# EAGLE board 8BIT_ADD_SUB (EAGLE 6.5.0), part 1 of 2
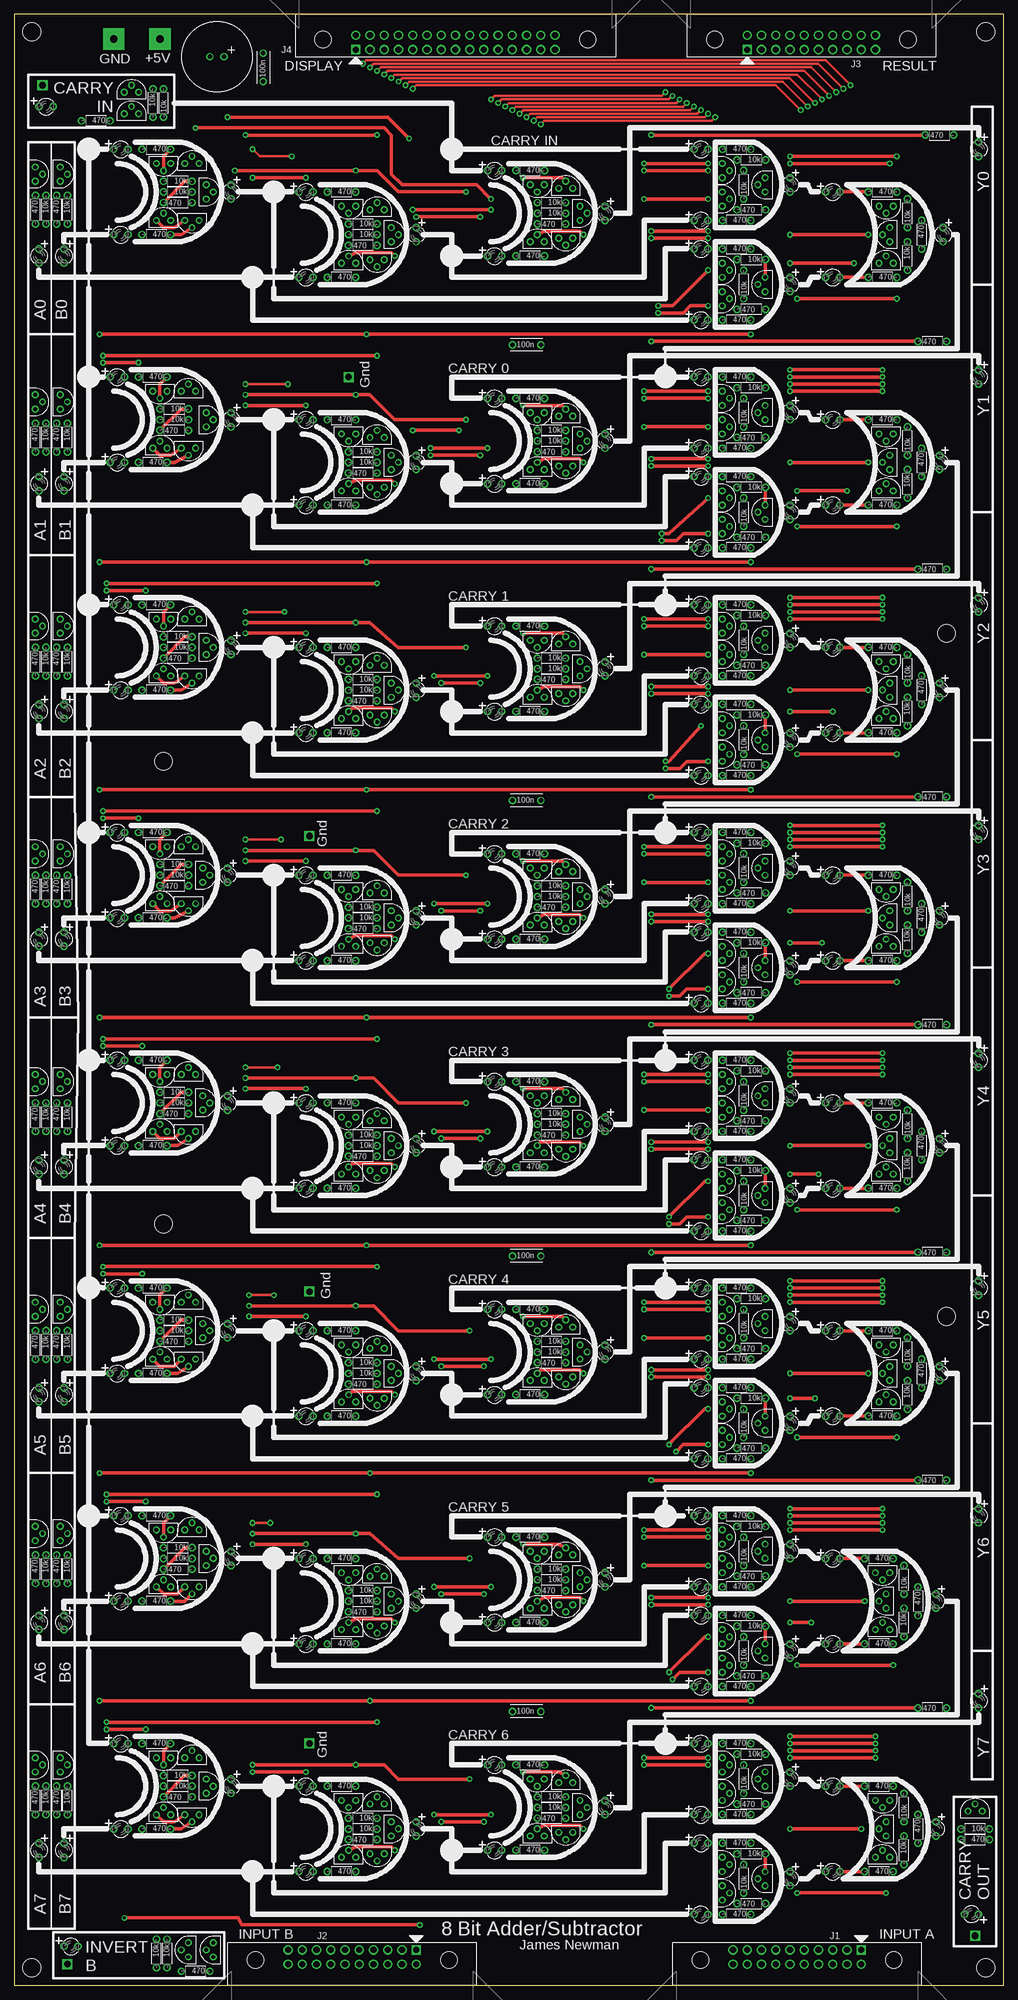
[diagram p25: board, top side]
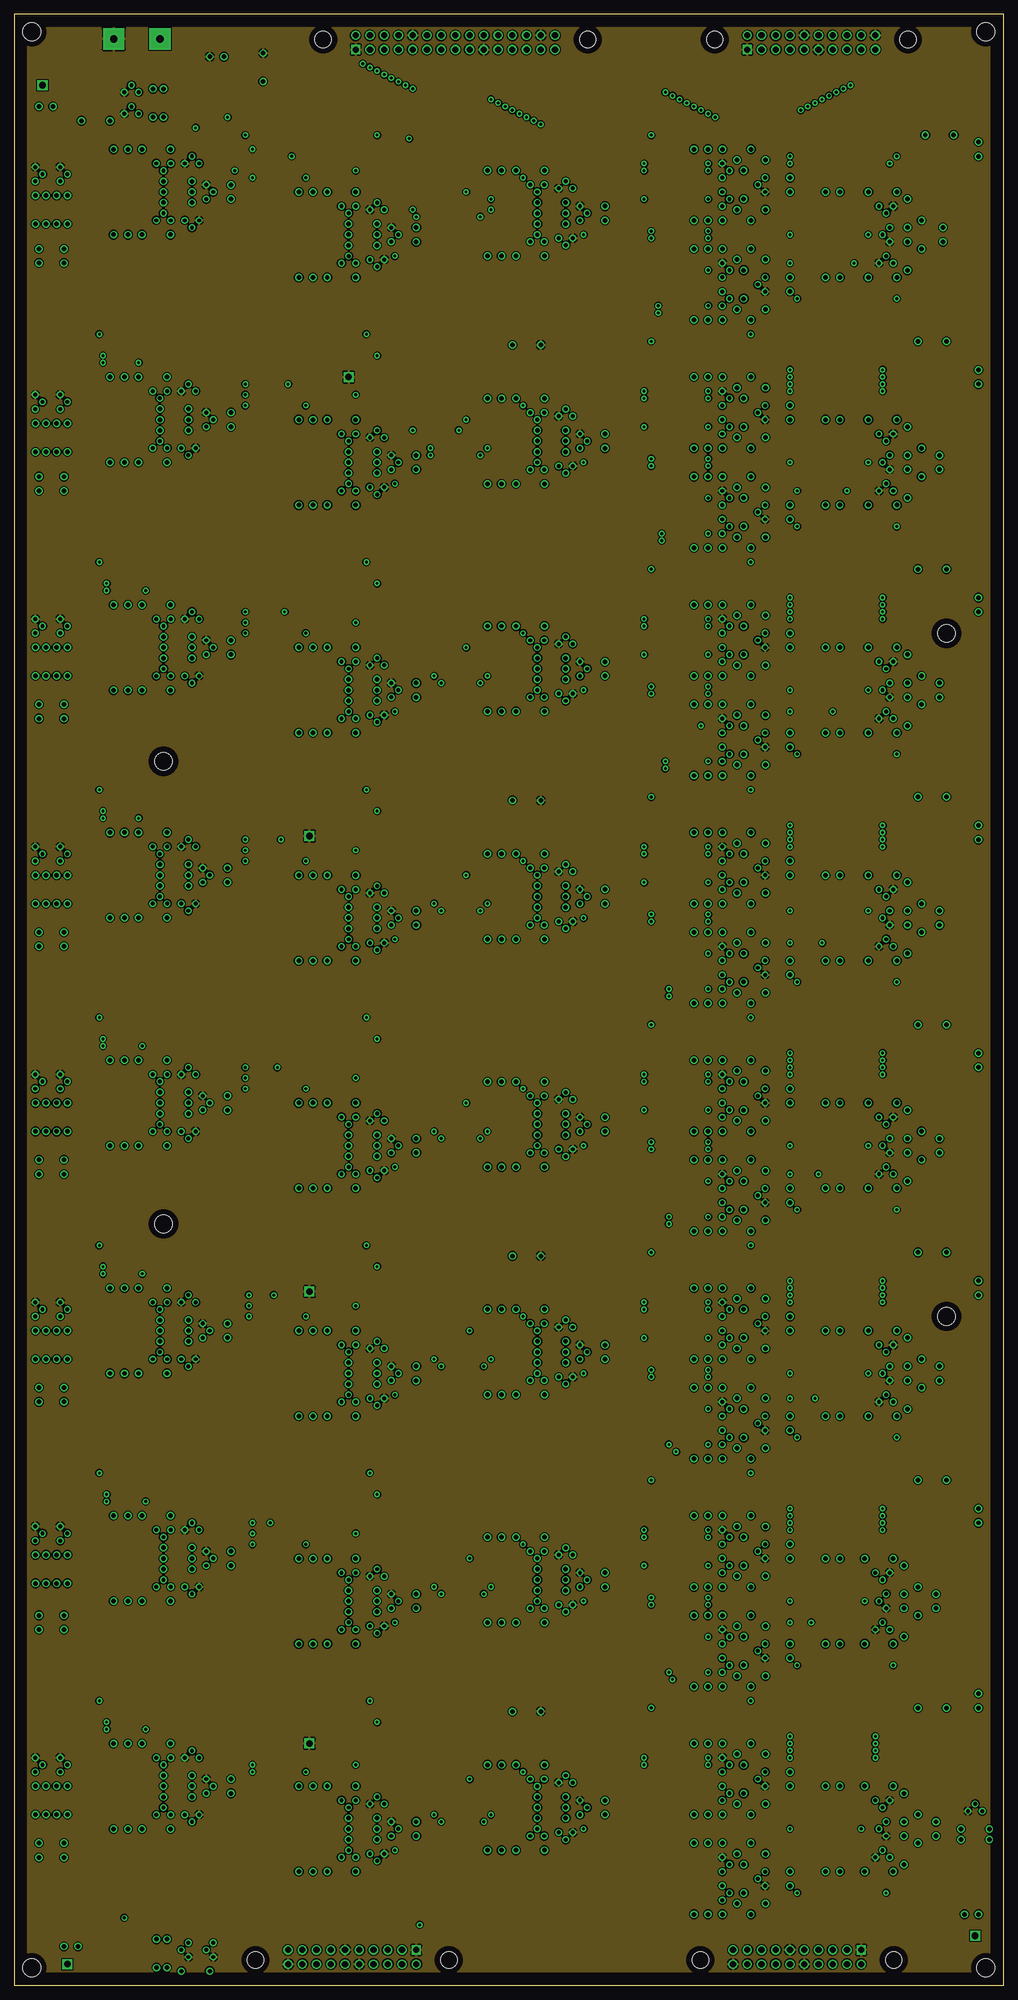
[diagram p26: board, inner layer Route2]
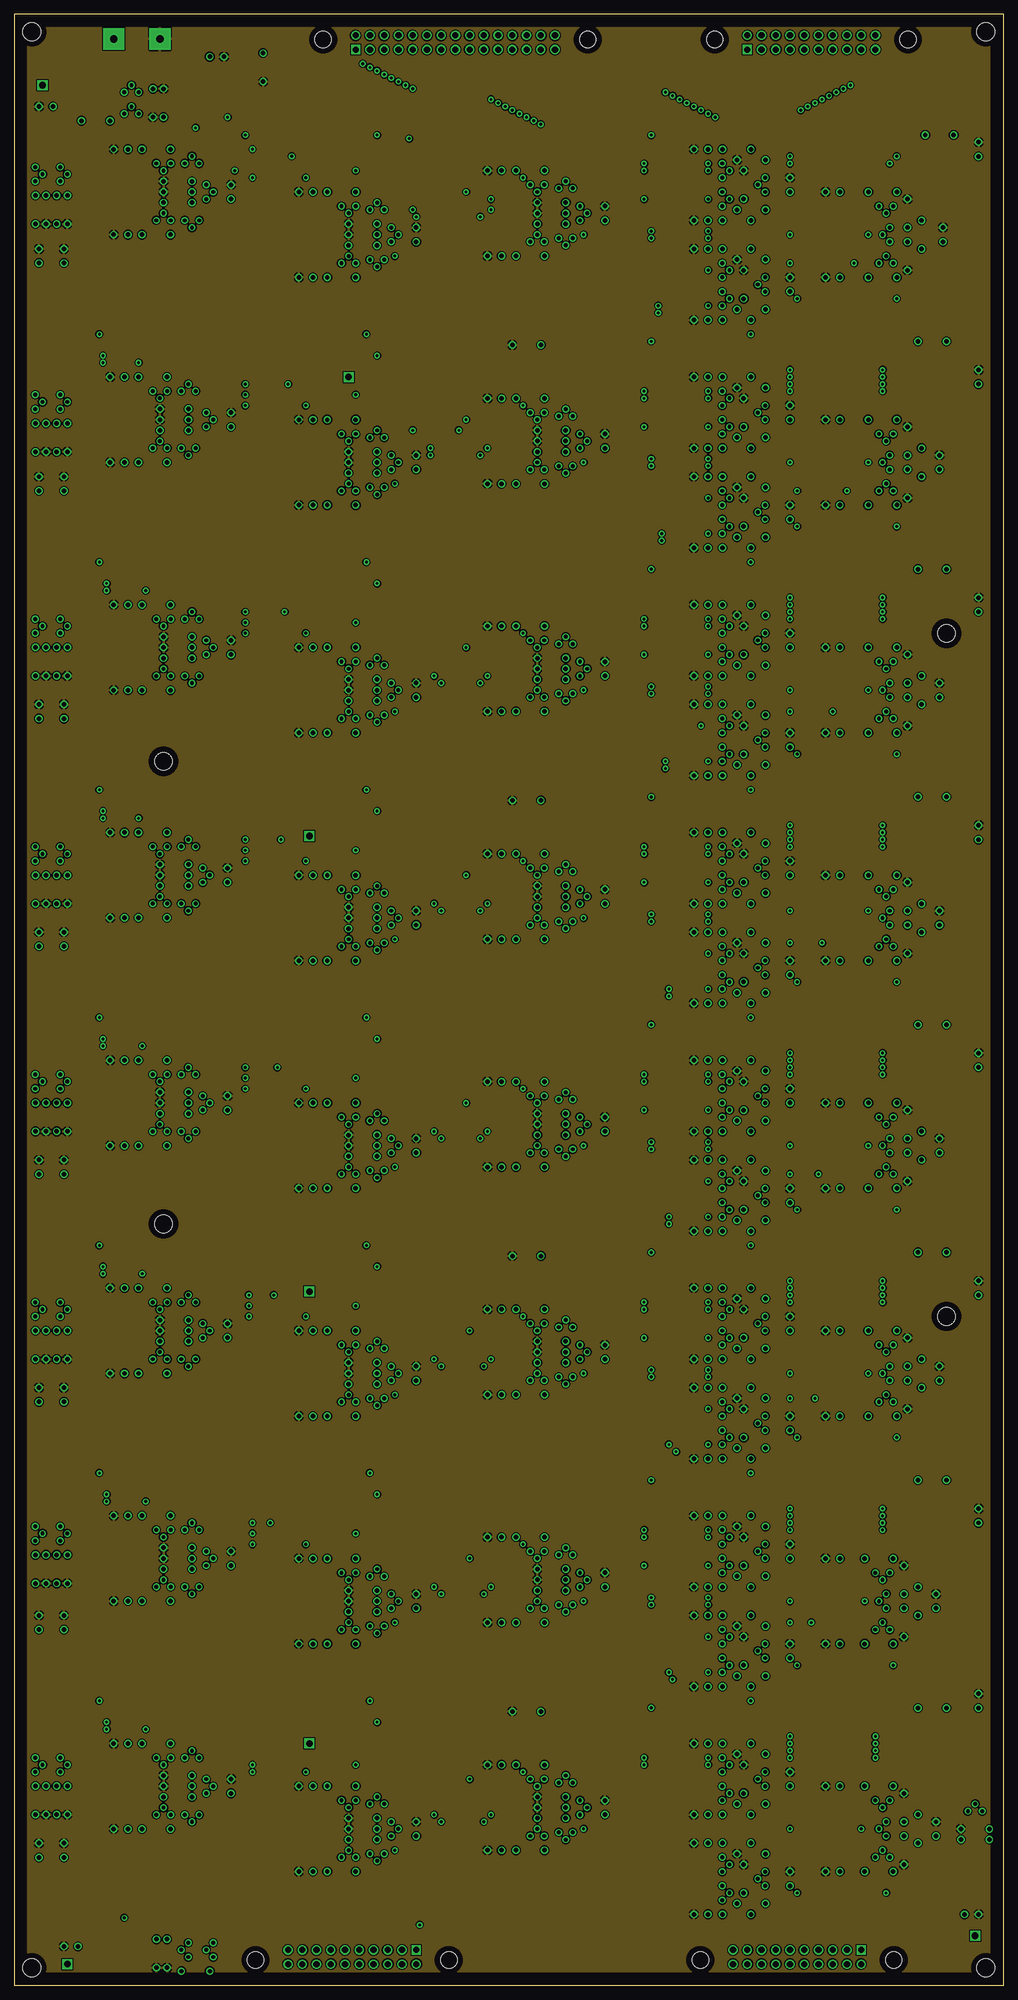
[diagram p27: board, inner layer Route3]
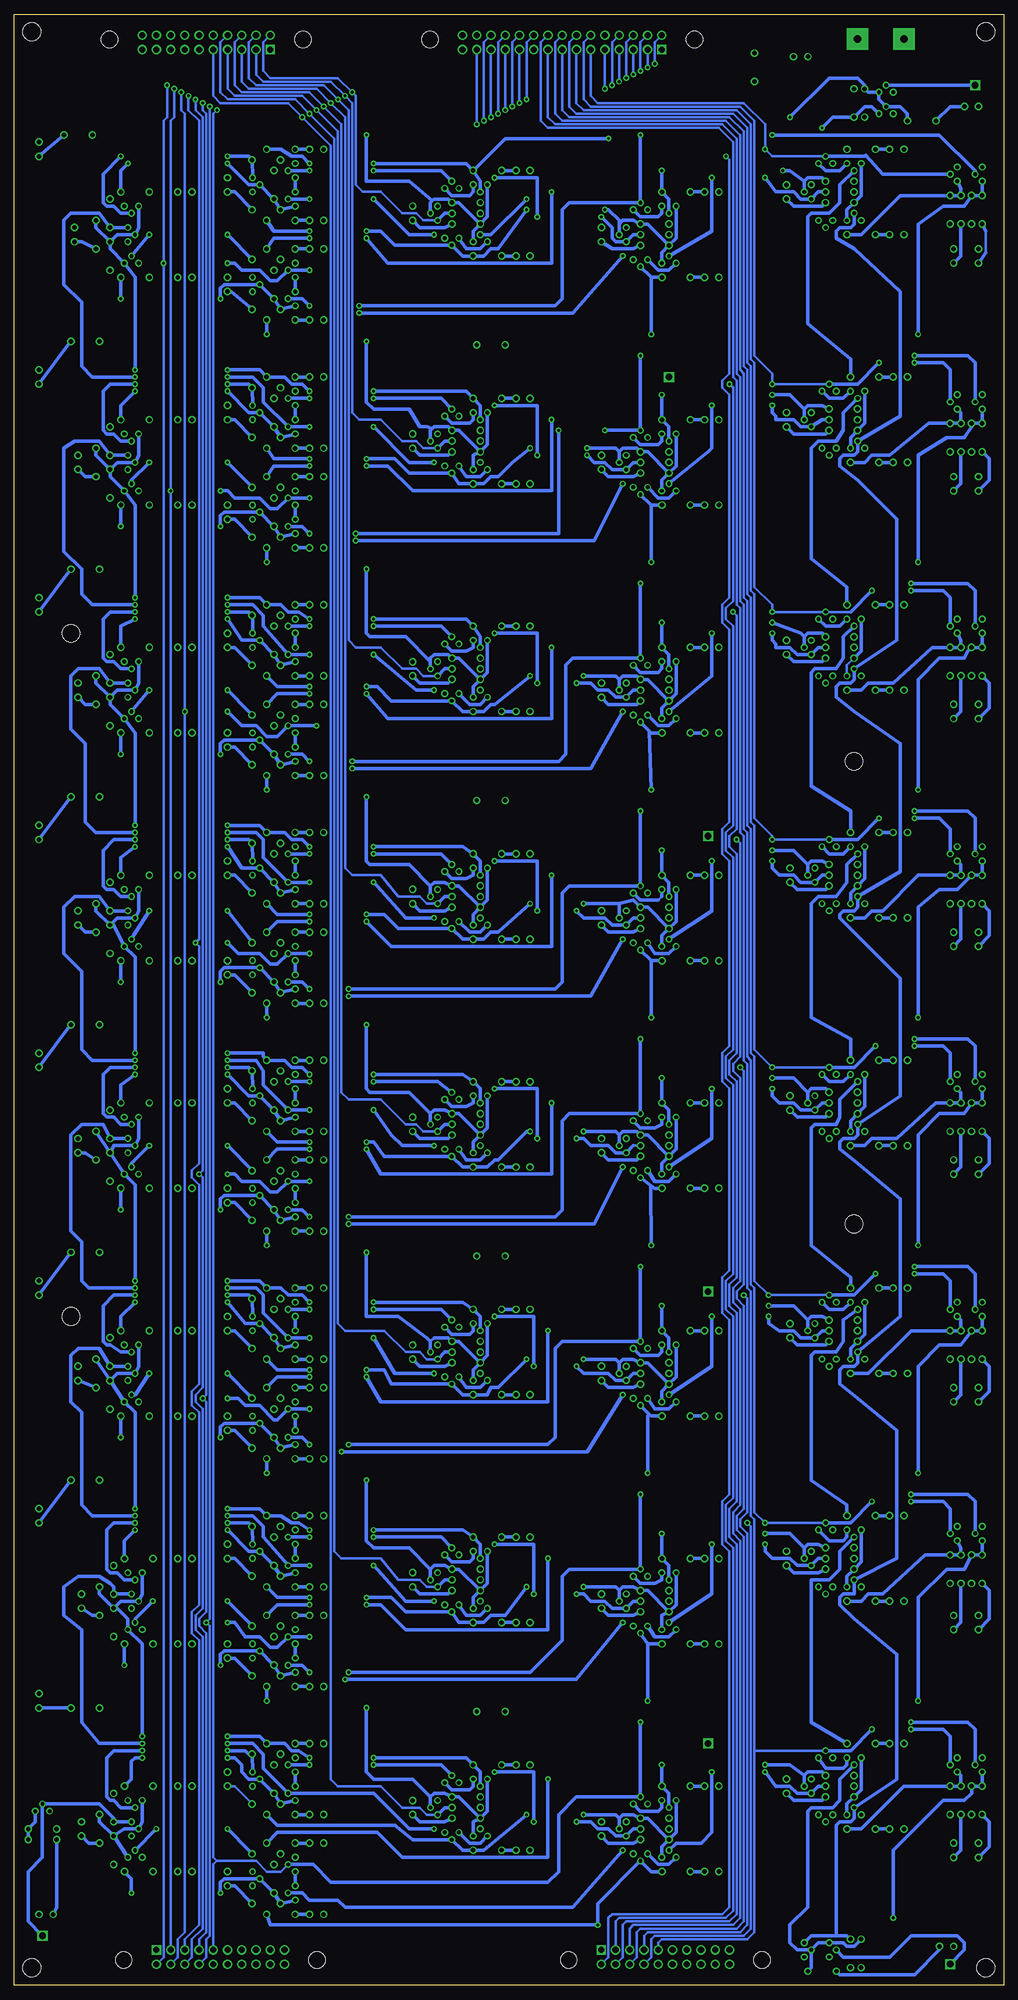
[diagram p28: board, bottom side, seen from below]

Size 176.53 x 351.79 mm. Coordinates in mm from the lower left corner, seen from the top.
Outline: 0,0 176.53,0 176.53,351.79 0,351.79 0,0
Copper layers (1*2+3*16): Top 0.035mm / dielectric 0.2mm / Route2 0.035mm / dielectric 1mm / Route3 0.035mm / dielectric 0.2mm / Bottom 0.035mm
Design rules "processor_rules_4layer": minimum track width 10mil, minimum drill 0.0236mm, track to track 8mil, track to pad 8mil, pad to pad 8mil, via to via 8mil, smd to smd 8mil, copper to edge 40mil, drill to drill 8mil, minimum pad ring 10mil, minimum via ring 8mil, stop-mask expansion 4mil, vias tented up to drill 0.7mm, thermal gap 10mil

## Footprints (pad centres in the part's own frame; a part is rotated, then mirrored left to right if it is on the bottom)
CAP_P2INCH = drill 0.8: 1 -2.54,0; 2 2.54,0
POLARISED_CAP_2P5 = drill 0.8: A 1.27,0; K -1.27,0
LED3MM = drill 0.8: A -1.27,0; K 1.27,0
3M_HOLE = hole 3.2: 0,0
20_HDR_LOCKING_RA = drill 1.1 square: 1 -11.43,-1.27 | drill 1.1: 2 -11.43,1.27; 3 -8.89,-1.27; 4 -8.89,1.27; 5 -6.35,-1.27; 6 -6.35,1.27; 7 -3.81,-1.27; 8 -3.81,1.27; 9 -1.27,-1.27; 10 -1.27,1.27; 11 1.27,-1.27; 12 1.27,1.27; 13 3.81,-1.27; 14 3.81,1.27; 15 6.35,-1.27; 16 6.35,1.27; 17 8.89,-1.27; 18 8.89,1.27; 19 11.43,-1.27; 20 11.43,1.27 | hole 2.946: -17.247,0.533; 17.247,0.533
30_HDR_LOCKING_RA = drill 1.1 square: 1 -17.78,-1.27 | drill 1.1: 2 -17.78,1.27; 3 -15.24,-1.27; 4 -15.24,1.27; 5 -12.7,-1.27; 6 -12.7,1.27; 7 -10.16,-1.27; 8 -10.16,1.27; 9 -7.62,-1.27; 10 -7.62,1.27; 11 -5.08,-1.27; 12 -5.08,1.27; 13 -2.54,-1.27; 14 -2.54,1.27; 15 0,-1.27; 16 0,1.27; 17 2.54,-1.27; 18 2.54,1.27; 19 5.08,-1.27; 20 5.08,1.27; 21 7.62,-1.27; 22 7.62,1.27; 23 10.16,-1.27; 24 10.16,1.27; 25 12.7,-1.27; 26 12.7,1.27; 27 15.24,-1.27; 28 15.24,1.27; 29 17.78,-1.27; 30 17.78,1.27 | hole 2.946: -23.597,0.533; 23.597,0.533
POWER_PAD = drill 1.3 pad 3.81 square: 1 0,0
TO92-DGS = drill 0.7: D 0,1.27; G -1.27,0; S 0,-1.27
R_P2INCH = drill 0.8: 1 -2.54,0; 2 2.54,0
TEST_LOOP = drill 1.2 square: P$1 0,0

## Placement (x,y rotation side)
C1  100n  [CAP_P2INCH]  44.45,342.26 90 top
C2  100n  [CAP_P2INCH]  91.44,292.74 0 top
C3  100n  [CAP_P2INCH]  91.44,211.46 0 top
C4  100n  [CAP_P2INCH]  91.44,130.18 0 top
C5  100n  [CAP_P2INCH]  91.44,48.9 0 top
C6  100uF  [POLARISED_CAP_2P5]  36.2,344.17 0 top
D1  L-1334SRT  [LED3MM]  38.73,238.76 270 top
D2  L-1334SRT  [LED3MM]  19.05,246.38 0 top
D3  L-1334SRT  [LED3MM]  19.05,231.14 0 top
D4  L-1334SRT  [LED3MM]  38.1,198.12 270 top
D5  L-1334SRT  [LED3MM]  18.41,205.74 0 top
D6  L-1334SRT  [LED3MM]  18.41,190.5 0 top
D7  L-1334SRT  [LED3MM]  38.1,157.48 270 top
D8  L-1334SRT  [LED3MM]  18.41,165.1 0 top
D9  L-1334SRT  [LED3MM]  18.41,149.86 0 top
D10  L-1334SRT  [LED3MM]  38.73,320.04 270 top
D11  L-1334SRT  [LED3MM]  19.05,327.66 0 top
D12  L-1334SRT  [LED3MM]  19.05,312.42 0 top
D13  L-1334SRT  [LED3MM]  38.73,279.4 270 top
D14  L-1334SRT  [LED3MM]  18.41,287.02 0 top
D15  L-1334SRT  [LED3MM]  18.41,271.78 0 top
D16  L-1334SRT  [LED3MM]  71.75,312.42 270 top
D17  L-1334SRT  [LED3MM]  52.07,320.04 0 top
D18  L-1334SRT  [LED3MM]  52.07,304.8 0 top
D19  L-1334SRT  [LED3MM]  105.41,316.23 270 top
D20  L-1334SRT  [LED3MM]  85.72,323.85 0 top
D21  L-1334SRT  [LED3MM]  85.72,308.61 0 top
D22  L-1334SRT  [LED3MM]  71.75,271.78 270 top
D23  L-1334SRT  [LED3MM]  52.07,279.4 0 top
D24  L-1334SRT  [LED3MM]  52.07,264.16 0 top
D25  L-1334SRT  [LED3MM]  105.41,275.59 270 top
D26  L-1334SRT  [LED3MM]  85.72,283.21 0 top
D27  L-1334SRT  [LED3MM]  85.72,267.97 0 top
D28  L-1334SRT  [LED3MM]  138.43,321.31 270 top
D29  L-1334SRT  [LED3MM]  122.56,327.66 0 top
D30  L-1334SRT  [LED3MM]  122.56,314.96 0 top
D31  L-1334SRT  [LED3MM]  165.74,312.42 270 top
D32  L-1334SRT  [LED3MM]  146.05,320.04 0 top
D33  L-1334SRT  [LED3MM]  146.05,304.8 0 top
D34  L-1334SRT  [LED3MM]  138.43,280.67 270 top
D35  L-1334SRT  [LED3MM]  122.56,287.02 0 top
D36  L-1334SRT  [LED3MM]  122.56,274.32 0 top
D37  L-1334SRT  [LED3MM]  165.1,271.78 270 top
D38  L-1334SRT  [LED3MM]  146.05,279.4 0 top
D39  L-1334SRT  [LED3MM]  146.05,264.16 0 top
D40  L-1334SRT  [LED3MM]  138.43,262.89 270 top
D41  L-1334SRT  [LED3MM]  122.56,269.24 0 top
D42  L-1334SRT  [LED3MM]  122.56,256.54 0 top
D43  L-1334SRT  [LED3MM]  138.43,303.53 270 top
D44  L-1334SRT  [LED3MM]  122.56,309.88 0 top
D45  L-1334SRT  [LED3MM]  122.56,297.18 0 top
D46  L-1334SRT  [LED3MM]  38.1,116.84 270 top
D47  L-1334SRT  [LED3MM]  18.41,124.46 0 top
D48  L-1334SRT  [LED3MM]  18.41,109.22 0 top
D49  L-1334SRT  [LED3MM]  38.73,76.2 270 top
D50  L-1334SRT  [LED3MM]  19.05,83.82 0 top
D51  L-1334SRT  [LED3MM]  19.05,68.58 0 top
D52  L-1334SRT  [LED3MM]  38.73,35.56 270 top
D53  L-1334SRT  [LED3MM]  19.05,43.18 0 top
D54  L-1334SRT  [LED3MM]  19.05,27.94 0 top
D55  L-1334SRT  [LED3MM]  71.75,231.14 270 top
D56  L-1334SRT  [LED3MM]  52.07,238.76 0 top
D57  L-1334SRT  [LED3MM]  52.07,223.52 0 top
D58  L-1334SRT  [LED3MM]  105.41,234.95 270 top
D59  L-1334SRT  [LED3MM]  85.72,242.57 0 top
D60  L-1334SRT  [LED3MM]  85.72,227.33 0 top
D61  L-1334SRT  [LED3MM]  71.75,190.5 270 top
D62  L-1334SRT  [LED3MM]  52.07,198.12 0 top
D63  L-1334SRT  [LED3MM]  52.07,182.88 0 top
D64  L-1334SRT  [LED3MM]  105.41,194.31 270 top
D65  L-1334SRT  [LED3MM]  85.72,201.93 0 top
D66  L-1334SRT  [LED3MM]  85.72,186.69 0 top
D67  L-1334SRT  [LED3MM]  71.75,149.86 270 top
D68  L-1334SRT  [LED3MM]  52.07,157.48 0 top
D69  L-1334SRT  [LED3MM]  52.07,142.24 0 top
D70  L-1334SRT  [LED3MM]  105.41,153.67 270 top
D71  L-1334SRT  [LED3MM]  85.72,161.29 0 top
D72  L-1334SRT  [LED3MM]  85.72,146.05 0 top
D73  L-1334SRT  [LED3MM]  71.75,109.22 270 top
D74  L-1334SRT  [LED3MM]  52.07,116.84 0 top
D75  L-1334SRT  [LED3MM]  52.07,101.6 0 top
D76  L-1334SRT  [LED3MM]  105.41,113.03 270 top
D77  L-1334SRT  [LED3MM]  85.72,120.65 0 top
D78  L-1334SRT  [LED3MM]  85.72,105.41 0 top
D79  L-1334SRT  [LED3MM]  71.75,68.58 270 top
D80  L-1334SRT  [LED3MM]  52.07,76.2 0 top
D81  L-1334SRT  [LED3MM]  52.07,60.96 0 top
D82  L-1334SRT  [LED3MM]  105.41,72.39 270 top
D83  L-1334SRT  [LED3MM]  85.72,80.01 0 top
D84  L-1334SRT  [LED3MM]  85.72,64.77 0 top
D85  L-1334SRT  [LED3MM]  71.75,27.94 270 top
D86  L-1334SRT  [LED3MM]  52.07,35.56 0 top
D87  L-1334SRT  [LED3MM]  52.07,20.32 0 top
D88  L-1334SRT  [LED3MM]  105.41,31.75 270 top
D89  L-1334SRT  [LED3MM]  85.72,39.37 0 top
D90  L-1334SRT  [LED3MM]  85.72,24.13 0 top
D91  L-1334SRT  [LED3MM]  138.43,240.03 270 top
D92  L-1334SRT  [LED3MM]  122.56,246.38 0 top
D93  L-1334SRT  [LED3MM]  122.56,233.68 0 top
D94  L-1334SRT  [LED3MM]  165.1,231.14 270 top
D95  L-1334SRT  [LED3MM]  146.05,238.76 0 top
D96  L-1334SRT  [LED3MM]  146.05,223.52 0 top
D97  L-1334SRT  [LED3MM]  138.43,222.25 270 top
D98  L-1334SRT  [LED3MM]  122.56,228.6 0 top
D99  L-1334SRT  [LED3MM]  122.56,215.9 0 top
D100  L-1334SRT  [LED3MM]  138.43,199.39 270 top
D101  L-1334SRT  [LED3MM]  122.56,205.74 0 top
D102  L-1334SRT  [LED3MM]  122.56,193.04 0 top
D103  L-1334SRT  [LED3MM]  165.1,190.5 270 top
D104  L-1334SRT  [LED3MM]  146.05,198.12 0 top
D105  L-1334SRT  [LED3MM]  146.05,182.88 0 top
D106  L-1334SRT  [LED3MM]  138.43,181.61 270 top
D107  L-1334SRT  [LED3MM]  122.56,187.96 0 top
D108  L-1334SRT  [LED3MM]  122.56,175.26 0 top
D109  L-1334SRT  [LED3MM]  138.43,158.75 270 top
D110  L-1334SRT  [LED3MM]  122.56,165.1 0 top
D111  L-1334SRT  [LED3MM]  122.56,152.4 0 top
D112  L-1334SRT  [LED3MM]  165.1,149.86 270 top
D113  L-1334SRT  [LED3MM]  146.05,157.48 0 top
D114  L-1334SRT  [LED3MM]  146.05,142.24 0 top
D115  L-1334SRT  [LED3MM]  138.43,140.97 270 top
D116  L-1334SRT  [LED3MM]  122.56,147.32 0 top
D117  L-1334SRT  [LED3MM]  122.56,134.62 0 top
D118  L-1334SRT  [LED3MM]  138.43,118.11 270 top
D119  L-1334SRT  [LED3MM]  122.56,124.46 0 top
D120  L-1334SRT  [LED3MM]  122.56,111.76 0 top
D121  L-1334SRT  [LED3MM]  165.1,109.22 270 top
D122  L-1334SRT  [LED3MM]  146.05,116.84 0 top
D123  L-1334SRT  [LED3MM]  146.05,101.6 0 top
D124  L-1334SRT  [LED3MM]  138.43,100.33 270 top
D125  L-1334SRT  [LED3MM]  122.56,106.68 0 top
D126  L-1334SRT  [LED3MM]  122.56,93.98 0 top
D127  L-1334SRT  [LED3MM]  138.43,77.47 270 top
D128  L-1334SRT  [LED3MM]  122.56,83.82 0 top
D129  L-1334SRT  [LED3MM]  122.56,71.12 0 top
D130  L-1334SRT  [LED3MM]  164.47,68.58 270 top
D131  L-1334SRT  [LED3MM]  146.05,76.2 0 top
D132  L-1334SRT  [LED3MM]  146.05,60.96 0 top
D133  L-1334SRT  [LED3MM]  138.43,59.69 270 top
D134  L-1334SRT  [LED3MM]  122.56,66.04 0 top
D135  L-1334SRT  [LED3MM]  122.56,53.34 0 top
D136  L-1334SRT  [LED3MM]  138.43,36.83 270 top
D137  L-1334SRT  [LED3MM]  122.56,43.18 0 top
D138  L-1334SRT  [LED3MM]  122.56,30.48 0 top
D139  L-1334SRT  [LED3MM]  164.47,27.94 270 top
D140  L-1334SRT  [LED3MM]  146.05,35.56 0 top
D141  L-1334SRT  [LED3MM]  146.05,20.32 0 top
D142  L-1334SRT  [LED3MM]  138.43,19.05 270 top
D143  L-1334SRT  [LED3MM]  122.56,25.4 0 top
D144  L-1334SRT  [LED3MM]  122.56,12.7 0 top
D145  L-1334SRT  [LED3MM]  8.89,186.69 270 top
D146  L-1334SRT  [LED3MM]  8.89,227.33 270 top
D147  L-1334SRT  [LED3MM]  8.89,267.97 270 top
D148  L-1334SRT  [LED3MM]  8.89,308.61 270 top
D149  L-1334SRT  [LED3MM]  4.45,227.33 270 top
D150  L-1334SRT  [LED3MM]  8.89,146.05 270 top
D151  L-1334SRT  [LED3MM]  8.89,105.41 270 top
D152  L-1334SRT  [LED3MM]  8.89,64.77 270 top
D153  L-1334SRT  [LED3MM]  8.89,24.13 270 top
D154  L-1334SRT  [LED3MM]  10.16,6.99 0 top
D155  L-1334SRT  [LED3MM]  4.45,308.61 270 top
D156  L-1334SRT  [LED3MM]  4.45,267.97 270 top
D157  L-1334SRT  [LED3MM]  4.45,146.05 270 top
D158  L-1334SRT  [LED3MM]  4.45,186.69 270 top
D159  L-1334SRT  [LED3MM]  4.45,105.41 270 top
D160  L-1334SRT  [LED3MM]  4.45,64.77 270 top
D161  L-1334SRT  [LED3MM]  4.45,24.13 270 top
D163  L-1334SRT  [LED3MM]  172.09,327.66 270 top
D164  L-1334SRT  [LED3MM]  172.09,287.02 270 top
D165  L-1334SRT  [LED3MM]  172.09,246.38 270 top
D166  L-1334SRT  [LED3MM]  172.09,205.74 270 top
D167  L-1334SRT  [LED3MM]  172.09,165.1 270 top
D168  L-1334SRT  [LED3MM]  172.09,124.46 270 top
D169  L-1334SRT  [LED3MM]  172.09,83.82 270 top
D170  L-1334SRT  [LED3MM]  172.09,50.8 270 top
D171  L-1334SRT  [LED3MM]  5.71,335.28 0 top
D172  L-1334SRT  [LED3MM]  170.81,12.7 180 top
HOLE1  3M_MOUNT_HOLE  [3M_HOLE]  26.67,218.44 0 top
HOLE2  3M_MOUNT_HOLE  [3M_HOLE]  173.35,348.62 0 top
HOLE3  3M_MOUNT_HOLE  [3M_HOLE]  166.37,241.3 0 top
HOLE4  3M_MOUNT_HOLE  [3M_HOLE]  3.17,348.62 0 top
HOLE5  3M_MOUNT_HOLE  [3M_HOLE]  166.37,119.38 0 top
HOLE6  3M_MOUNT_HOLE  [3M_HOLE]  26.67,135.89 0 top
HOLE7  3M_MOUNT_HOLE  [3M_HOLE]  3.17,3.17 0 top
HOLE8  3M_MOUNT_HOLE  [3M_HOLE]  173.35,3.17 0 top
J1  20_HDR_LOCKING_RA  [20_HDR_LOCKING_RA]  139.7,5.08 180 top
J2  20_HDR_LOCKING_RA  [20_HDR_LOCKING_RA]  60.33,5.08 180 top
J3  20_HDR_LOCKING_RA  [20_HDR_LOCKING_RA]  142.24,346.71 0 top
J4  30_HDR_LOCKING_RA  [30_HDR_LOCKING_RA]  78.74,346.71 0 top
PP1  POWER_PAD  [POWER_PAD]  26.04,347.35 90 top
PP2  POWER_PAD  [POWER_PAD]  17.78,347.35 90 top
Q1  2N7000  [TO92-DGS]  26.67,233.68 270 top
Q2  2N7000  [TO92-DGS]  31.75,233.68 90 top
Q3  2N7000  [TO92-DGS]  26.67,243.84 90 top
Q4  2N7000  [TO92-DGS]  31.75,243.84 270 top
Q5  2N7000  [TO92-DGS]  34.29,238.76 180 top
Q6  2N7000  [TO92-DGS]  26.04,193.04 270 top
Q7  2N7000  [TO92-DGS]  31.11,193.04 90 top
Q8  2N7000  [TO92-DGS]  26.04,203.2 90 top
Q9  2N7000  [TO92-DGS]  31.11,203.2 270 top
Q10  2N7000  [TO92-DGS]  33.66,198.12 180 top
Q11  2N7000  [TO92-DGS]  26.04,152.4 270 top
Q12  2N7000  [TO92-DGS]  26.67,314.96 270 top
Q13  2N7000  [TO92-DGS]  31.75,314.96 90 top
Q14  2N7000  [TO92-DGS]  26.67,325.12 90 top
Q15  2N7000  [TO92-DGS]  31.75,325.12 270 top
Q16  2N7000  [TO92-DGS]  34.29,320.04 180 top
Q17  2N7000  [TO92-DGS]  26.04,274.32 270 top
Q18  2N7000  [TO92-DGS]  31.11,274.32 90 top
Q19  2N7000  [TO92-DGS]  26.04,284.48 90 top
Q20  2N7000  [TO92-DGS]  31.11,284.48 270 top
Q21  2N7000  [TO92-DGS]  34.29,279.4 180 top
Q22  2N7000  [TO92-DGS]  59.69,307.34 270 top
Q23  2N7000  [TO92-DGS]  64.77,307.98 90 top
Q24  2N7000  [TO92-DGS]  59.69,317.5 90 top
Q25  2N7000  [TO92-DGS]  64.77,316.87 270 top
Q26  2N7000  [TO92-DGS]  67.31,312.42 180 top
Q27  2N7000  [TO92-DGS]  93.34,311.15 270 top
Q28  2N7000  [TO92-DGS]  98.42,311.79 90 top
Q29  2N7000  [TO92-DGS]  93.34,321.31 90 top
Q30  2N7000  [TO92-DGS]  98.42,320.68 270 top
Q31  2N7000  [TO92-DGS]  100.97,316.23 180 top
Q32  2N7000  [TO92-DGS]  59.69,266.7 270 top
Q33  2N7000  [TO92-DGS]  64.77,267.33 90 top
Q34  2N7000  [TO92-DGS]  59.69,276.86 90 top
Q35  2N7000  [TO92-DGS]  64.77,276.23 270 top
Q36  2N7000  [TO92-DGS]  67.31,271.78 180 top
Q37  2N7000  [TO92-DGS]  93.34,270.51 270 top
Q38  2N7000  [TO92-DGS]  98.42,271.14 90 top
Q39  2N7000  [TO92-DGS]  93.34,280.67 90 top
Q40  2N7000  [TO92-DGS]  98.42,280.04 270 top
Q41  2N7000  [TO92-DGS]  100.97,275.59 180 top
Q42  2N7000  [TO92-DGS]  126.36,318.77 180 top
Q43  2N7000  [TO92-DGS]  126.36,323.85 180 top
Q44  2N7000  [TO92-DGS]  133.99,321.31 0 top
Q45  2N7000  [TO92-DGS]  155.57,317.5 90 top
Q46  2N7000  [TO92-DGS]  155.57,307.34 270 top
Q47  2N7000  [TO92-DGS]  156.21,312.42 0 top
Q48  2N7000  [TO92-DGS]  126.36,278.13 180 top
Q49  2N7000  [TO92-DGS]  126.36,283.21 180 top
Q50  2N7000  [TO92-DGS]  133.99,280.67 0 top
Q51  2N7000  [TO92-DGS]  155.57,276.86 90 top
Q52  2N7000  [TO92-DGS]  155.57,266.7 270 top
Q53  2N7000  [TO92-DGS]  156.21,271.78 0 top
Q54  2N7000  [TO92-DGS]  126.36,260.35 180 top
Q55  2N7000  [TO92-DGS]  126.36,265.43 180 top
Q56  2N7000  [TO92-DGS]  133.99,262.89 0 top
Q57  2N7000  [TO92-DGS]  126.36,300.99 180 top
Q58  2N7000  [TO92-DGS]  126.36,306.07 180 top
Q59  2N7000  [TO92-DGS]  133.99,303.53 0 top
Q60  2N7000  [TO92-DGS]  31.11,152.4 90 top
Q61  2N7000  [TO92-DGS]  26.04,162.56 90 top
Q62  2N7000  [TO92-DGS]  31.11,162.56 270 top
Q63  2N7000  [TO92-DGS]  33.66,157.48 180 top
Q64  2N7000  [TO92-DGS]  26.04,111.76 270 top
Q65  2N7000  [TO92-DGS]  31.11,111.76 90 top
Q66  2N7000  [TO92-DGS]  26.04,121.92 90 top
Q67  2N7000  [TO92-DGS]  31.11,121.92 270 top
Q68  2N7000  [TO92-DGS]  33.66,116.84 180 top
Q69  2N7000  [TO92-DGS]  26.67,71.12 270 top
Q70  2N7000  [TO92-DGS]  31.75,71.12 90 top
Q71  2N7000  [TO92-DGS]  26.67,81.28 90 top
Q72  2N7000  [TO92-DGS]  31.75,81.28 270 top
Q73  2N7000  [TO92-DGS]  34.29,76.2 180 top
Q74  2N7000  [TO92-DGS]  26.67,30.48 270 top
Q75  2N7000  [TO92-DGS]  31.75,30.48 90 top
Q76  2N7000  [TO92-DGS]  26.67,40.64 90 top
Q77  2N7000  [TO92-DGS]  31.75,40.64 270 top
Q78  2N7000  [TO92-DGS]  34.29,35.56 180 top
Q79  2N7000  [TO92-DGS]  59.69,226.06 270 top
Q80  2N7000  [TO92-DGS]  64.77,226.69 90 top
Q81  2N7000  [TO92-DGS]  59.69,236.22 90 top
Q82  2N7000  [TO92-DGS]  64.77,235.59 270 top
Q83  2N7000  [TO92-DGS]  67.31,231.14 180 top
Q84  2N7000  [TO92-DGS]  93.34,229.87 270 top
Q85  2N7000  [TO92-DGS]  98.42,230.5 90 top
Q86  2N7000  [TO92-DGS]  93.34,240.03 90 top
Q87  2N7000  [TO92-DGS]  98.42,239.4 270 top
Q88  2N7000  [TO92-DGS]  100.97,234.95 180 top
Q89  2N7000  [TO92-DGS]  59.69,185.42 270 top
Q90  2N7000  [TO92-DGS]  64.77,186.06 90 top
Q91  2N7000  [TO92-DGS]  59.69,195.58 90 top
Q92  2N7000  [TO92-DGS]  64.77,194.94 270 top
Q93  2N7000  [TO92-DGS]  67.31,190.5 180 top
Q94  2N7000  [TO92-DGS]  93.34,189.23 270 top
Q95  2N7000  [TO92-DGS]  98.42,189.87 90 top
Q96  2N7000  [TO92-DGS]  93.34,199.39 90 top
Q97  2N7000  [TO92-DGS]  98.42,198.75 270 top
Q98  2N7000  [TO92-DGS]  100.97,194.31 180 top
Q99  2N7000  [TO92-DGS]  59.69,144.78 270 top
Q100  2N7000  [TO92-DGS]  64.77,145.41 90 top
Q101  2N7000  [TO92-DGS]  59.69,154.94 90 top
Q102  2N7000  [TO92-DGS]  64.77,154.31 270 top
Q103  2N7000  [TO92-DGS]  67.31,149.86 180 top
Q104  2N7000  [TO92-DGS]  93.34,148.59 270 top
Q105  2N7000  [TO92-DGS]  98.42,149.22 90 top
Q106  2N7000  [TO92-DGS]  93.34,158.75 90 top
Q107  2N7000  [TO92-DGS]  98.42,158.12 270 top
Q108  2N7000  [TO92-DGS]  100.97,153.67 180 top
Q109  2N7000  [TO92-DGS]  59.69,104.14 270 top
Q110  2N7000  [TO92-DGS]  64.77,104.78 90 top
Q111  2N7000  [TO92-DGS]  59.69,114.3 90 top
Q112  2N7000  [TO92-DGS]  64.77,113.67 270 top
Q113  2N7000  [TO92-DGS]  67.31,109.22 180 top
Q114  2N7000  [TO92-DGS]  93.34,107.95 270 top
Q115  2N7000  [TO92-DGS]  98.42,108.58 90 top
Q116  2N7000  [TO92-DGS]  93.34,118.11 90 top
Q117  2N7000  [TO92-DGS]  98.42,117.47 270 top
Q118  2N7000  [TO92-DGS]  100.97,113.03 180 top
Q119  2N7000  [TO92-DGS]  59.69,63.5 270 top
Q120  2N7000  [TO92-DGS]  64.77,64.14 90 top
Q121  2N7000  [TO92-DGS]  59.69,73.66 90 top
Q122  2N7000  [TO92-DGS]  64.77,73.03 270 top
Q123  2N7000  [TO92-DGS]  67.31,68.58 180 top
Q124  2N7000  [TO92-DGS]  93.34,67.31 270 top
Q125  2N7000  [TO92-DGS]  98.42,67.94 90 top
Q126  2N7000  [TO92-DGS]  93.34,77.47 90 top
Q127  2N7000  [TO92-DGS]  98.42,76.83 270 top
Q128  2N7000  [TO92-DGS]  100.97,72.39 180 top
Q129  2N7000  [TO92-DGS]  59.69,22.86 270 top
Q130  2N7000  [TO92-DGS]  64.77,23.5 90 top
Q131  2N7000  [TO92-DGS]  59.69,33.02 90 top
Q132  2N7000  [TO92-DGS]  64.77,32.38 270 top
Q133  2N7000  [TO92-DGS]  67.31,27.94 180 top
Q134  2N7000  [TO92-DGS]  93.34,26.67 270 top
Q135  2N7000  [TO92-DGS]  98.42,27.3 90 top
Q136  2N7000  [TO92-DGS]  93.34,36.83 90 top
Q137  2N7000  [TO92-DGS]  98.42,36.2 270 top
Q138  2N7000  [TO92-DGS]  100.97,31.75 180 top
Q139  2N7000  [TO92-DGS]  126.36,237.49 180 top
Q140  2N7000  [TO92-DGS]  126.36,242.57 180 top
Q141  2N7000  [TO92-DGS]  133.99,240.03 0 top
Q142  2N7000  [TO92-DGS]  155.57,236.22 90 top
Q143  2N7000  [TO92-DGS]  155.57,226.06 270 top
Q144  2N7000  [TO92-DGS]  156.21,231.14 0 top
Q145  2N7000  [TO92-DGS]  126.36,219.71 180 top
Q146  2N7000  [TO92-DGS]  126.36,224.79 180 top
Q147  2N7000  [TO92-DGS]  133.99,222.25 0 top
Q148  2N7000  [TO92-DGS]  126.36,196.85 180 top
Q149  2N7000  [TO92-DGS]  126.36,201.93 180 top
Q150  2N7000  [TO92-DGS]  133.99,199.39 0 top
Q151  2N7000  [TO92-DGS]  155.57,195.58 90 top
Q152  2N7000  [TO92-DGS]  155.57,185.42 270 top
Q153  2N7000  [TO92-DGS]  156.21,190.5 0 top
Q154  2N7000  [TO92-DGS]  126.36,179.07 180 top
Q155  2N7000  [TO92-DGS]  126.36,184.15 180 top
Q156  2N7000  [TO92-DGS]  133.99,181.61 0 top
Q157  2N7000  [TO92-DGS]  126.36,156.21 180 top
Q158  2N7000  [TO92-DGS]  126.36,161.29 180 top
Q159  2N7000  [TO92-DGS]  133.99,158.75 0 top
Q160  2N7000  [TO92-DGS]  155.57,154.94 90 top
Q161  2N7000  [TO92-DGS]  155.57,144.78 270 top
Q162  2N7000  [TO92-DGS]  156.21,149.86 0 top
Q163  2N7000  [TO92-DGS]  126.36,138.43 180 top
Q164  2N7000  [TO92-DGS]  126.36,143.51 180 top
Q165  2N7000  [TO92-DGS]  133.99,140.97 0 top
Q166  2N7000  [TO92-DGS]  126.36,115.57 180 top
Q167  2N7000  [TO92-DGS]  126.36,120.65 180 top
Q168  2N7000  [TO92-DGS]  133.99,118.11 0 top
Q169  2N7000  [TO92-DGS]  155.57,114.3 90 top
Q170  2N7000  [TO92-DGS]  155.57,104.14 270 top
Q171  2N7000  [TO92-DGS]  156.21,109.22 0 top
Q172  2N7000  [TO92-DGS]  126.36,97.79 180 top
Q173  2N7000  [TO92-DGS]  126.36,102.87 180 top
Q174  2N7000  [TO92-DGS]  133.99,100.33 0 top
Q175  2N7000  [TO92-DGS]  126.36,74.93 180 top
Q176  2N7000  [TO92-DGS]  126.36,80.01 180 top
Q177  2N7000  [TO92-DGS]  133.99,77.47 0 top
Q178  2N7000  [TO92-DGS]  154.94,73.66 90 top
Q179  2N7000  [TO92-DGS]  154.94,63.5 270 top
Q180  2N7000  [TO92-DGS]  155.57,68.58 0 top
Q181  2N7000  [TO92-DGS]  126.36,57.15 180 top
Q182  2N7000  [TO92-DGS]  126.36,62.23 180 top
Q183  2N7000  [TO92-DGS]  133.99,59.69 0 top
Q184  2N7000  [TO92-DGS]  126.36,34.29 180 top
Q185  2N7000  [TO92-DGS]  126.36,39.37 180 top
Q186  2N7000  [TO92-DGS]  133.99,36.83 0 top
Q187  2N7000  [TO92-DGS]  154.94,33.02 90 top
Q188  2N7000  [TO92-DGS]  154.94,22.86 270 top
Q189  2N7000  [TO92-DGS]  155.57,27.94 0 top
Q190  2N7000  [TO92-DGS]  126.36,16.51 180 top
Q191  2N7000  [TO92-DGS]  126.36,21.59 180 top
Q192  2N7000  [TO92-DGS]  133.99,19.05 0 top
Q193  2N7000  [TO92-DGS]  3.81,323.21 180 top
Q194  2N7000  [TO92-DGS]  3.81,282.57 180 top
Q195  2N7000  [TO92-DGS]  3.81,242.57 180 top
Q196  2N7000  [TO92-DGS]  3.81,201.93 180 top
Q197  2N7000  [TO92-DGS]  3.81,161.29 180 top
Q198  2N7000  [TO92-DGS]  3.81,120.65 180 top
Q199  2N7000  [TO92-DGS]  3.81,80.64 180 top
Q200  2N7000  [TO92-DGS]  3.81,39.37 180 top
Q201  2N7000  [TO92-DGS]  8.26,323.21 180 top
Q202  2N7000  [TO92-DGS]  8.26,282.57 180 top
Q203  2N7000  [TO92-DGS]  8.26,242.57 180 top
Q204  2N7000  [TO92-DGS]  8.26,201.93 180 top
Q205  2N7000  [TO92-DGS]  8.26,161.29 180 top
Q206  2N7000  [TO92-DGS]  8.26,120.65 180 top
Q207  2N7000  [TO92-DGS]  8.26,80.64 180 top
Q208  2N7000  [TO92-DGS]  8.26,39.37 180 top
Q209  2N7000  [TO92-DGS]  31.11,6.35 0 top
Q210  2N7000  [TO92-DGS]  35.56,6.35 0 top
Q211  2N7000  [TO92-DGS]  171.45,31.11 270 top
Q212  2N7000  [TO92-DGS]  20.95,337.82 270 top
Q213  2N7000  [TO92-DGS]  20.95,334.01 270 top
R1  10k  [R_P2INCH]  29.21,240.66 180 top
R2  470  [R_P2INCH]  29.21,236.85 0 top
R3  10k  [R_P2INCH]  29.21,238.76 180 top
R4  470  [R_P2INCH]  25.4,246.38 180 top
R5  470  [R_P2INCH]  25.4,231.14 180 top
R6  10k  [R_P2INCH]  28.57,200.03 180 top
R7  470  [R_P2INCH]  28.57,196.22 0 top
R8  10k  [R_P2INCH]  28.57,198.12 180 top
R9  470  [R_P2INCH]  24.77,205.74 180 top
R10  470  [R_P2INCH]  24.77,190.5 180 top
R11  10k  [R_P2INCH]  28.57,159.38 180 top
R12  470  [R_P2INCH]  28.57,155.57 0 top
R13  10k  [R_P2INCH]  28.57,157.48 180 top
R14  470  [R_P2INCH]  24.77,165.1 180 top
R15  470  [R_P2INCH]  24.77,149.86 180 top
R16  10k  [R_P2INCH]  29.21,321.94 180 top
R17  470  [R_P2INCH]  29.21,318.13 0 top
R18  10k  [R_P2INCH]  29.21,320.04 180 top
R19  470  [R_P2INCH]  25.4,327.66 180 top
R20  470  [R_P2INCH]  25.4,312.42 180 top
R21  10k  [R_P2INCH]  28.57,281.31 180 top
R22  470  [R_P2INCH]  28.57,277.5 0 top
R23  10k  [R_P2INCH]  28.57,279.4 180 top
R24  470  [R_P2INCH]  24.77,287.02 180 top
R25  470  [R_P2INCH]  24.77,271.78 180 top
R26  10k  [R_P2INCH]  62.23,314.32 180 top
R27  470  [R_P2INCH]  62.23,310.51 0 top
R28  10k  [R_P2INCH]  62.23,312.42 180 top
R29  470  [R_P2INCH]  58.42,320.04 180 top
R30  470  [R_P2INCH]  58.42,304.8 180 top
R31  10k  [R_P2INCH]  95.89,318.13 180 top
R32  470  [R_P2INCH]  95.89,314.32 0 top
R33  10k  [R_P2INCH]  95.89,316.23 180 top
R34  470  [R_P2INCH]  92.08,323.85 180 top
R35  470  [R_P2INCH]  92.08,308.61 180 top
R36  10k  [R_P2INCH]  62.23,273.69 180 top
R37  470  [R_P2INCH]  62.23,269.88 0 top
R38  10k  [R_P2INCH]  62.23,271.78 180 top
R39  470  [R_P2INCH]  58.42,279.4 180 top
R40  470  [R_P2INCH]  58.42,264.16 180 top
R41  10k  [R_P2INCH]  95.89,277.5 180 top
R42  470  [R_P2INCH]  95.89,273.69 0 top
R43  10k  [R_P2INCH]  95.89,275.59 180 top
R44  470  [R_P2INCH]  92.08,283.21 180 top
R45  470  [R_P2INCH]  92.08,267.97 180 top
R46  10k  [R_P2INCH]  130.18,321.31 90 top
R47  470  [R_P2INCH]  131.52,316.87 0 top
R48  10k  [R_P2INCH]  131.52,325.75 180 top
R49  470  [R_P2INCH]  128.91,327.66 180 top
R50  470  [R_P2INCH]  128.91,314.96 180 top
R51  10k  [R_P2INCH]  159.38,308.61 270 top
R52  470  [R_P2INCH]  161.93,312.42 270 top
R53  10k  [R_P2INCH]  159.38,316.23 90 top
R54  470  [R_P2INCH]  154.94,320.04 180 top
R55  470  [R_P2INCH]  154.94,304.8 180 top
R56  10k  [R_P2INCH]  130.18,280.67 90 top
R57  470  [R_P2INCH]  131.52,276.23 0 top
R58  10k  [R_P2INCH]  131.52,285.12 180 top
R59  470  [R_P2INCH]  128.91,287.02 180 top
R60  470  [R_P2INCH]  128.91,274.32 180 top
R61  10k  [R_P2INCH]  159.38,267.97 270 top
R62  470  [R_P2INCH]  161.93,271.78 270 top
R63  10k  [R_P2INCH]  159.38,275.59 90 top
R64  470  [R_P2INCH]  154.94,279.4 180 top
R65  470  [R_P2INCH]  154.94,264.16 180 top
R66  10k  [R_P2INCH]  130.18,262.89 90 top
R67  470  [R_P2INCH]  131.52,258.44 0 top
R68  10k  [R_P2INCH]  131.52,267.33 180 top
R69  470  [R_P2INCH]  128.91,269.24 180 top
R70  470  [R_P2INCH]  128.91,256.54 180 top
R71  10k  [R_P2INCH]  130.18,303.53 90 top
R72  470  [R_P2INCH]  131.52,299.08 0 top
R73  10k  [R_P2INCH]  131.52,307.98 180 top
R74  470  [R_P2INCH]  128.91,309.88 180 top
R75  470  [R_P2INCH]  128.91,297.18 180 top
R76  10k  [R_P2INCH]  28.57,118.75 180 top
R77  470  [R_P2INCH]  28.57,114.94 0 top
R78  10k  [R_P2INCH]  28.57,116.84 180 top
R79  470  [R_P2INCH]  24.77,124.46 180 top
R80  470  [R_P2INCH]  24.77,109.22 180 top
R81  10k  [R_P2INCH]  29.21,78.11 180 top
R82  470  [R_P2INCH]  29.21,74.3 0 top
R83  10k  [R_P2INCH]  29.21,76.2 180 top
R84  470  [R_P2INCH]  25.4,83.82 180 top
R85  470  [R_P2INCH]  25.4,68.58 180 top
R86  10k  [R_P2INCH]  29.21,37.47 180 top
R87  470  [R_P2INCH]  29.21,33.66 0 top
R88  10k  [R_P2INCH]  29.21,35.56 180 top
R89  470  [R_P2INCH]  25.4,43.18 180 top
R90  470  [R_P2INCH]  25.4,27.94 180 top
R91  10k  [R_P2INCH]  62.23,233.04 180 top
R92  470  [R_P2INCH]  62.23,229.24 0 top
R93  10k  [R_P2INCH]  62.23,231.14 180 top
R94  470  [R_P2INCH]  58.42,238.76 180 top
R95  470  [R_P2INCH]  58.42,223.52 180 top
R96  10k  [R_P2INCH]  95.89,236.85 180 top
R97  470  [R_P2INCH]  95.89,233.04 0 top
R98  10k  [R_P2INCH]  95.89,234.95 180 top
R99  470  [R_P2INCH]  92.08,242.57 180 top
R100  470  [R_P2INCH]  92.08,227.33 180 top
R101  10k  [R_P2INCH]  62.23,192.41 180 top
R102  470  [R_P2INCH]  62.23,188.59 0 top
R103  10k  [R_P2INCH]  62.23,190.5 180 top
R104  470  [R_P2INCH]  58.42,198.12 180 top
R105  470  [R_P2INCH]  58.42,182.88 180 top
R106  10k  [R_P2INCH]  95.89,196.22 180 top
R107  470  [R_P2INCH]  95.89,192.41 0 top
R108  10k  [R_P2INCH]  95.89,194.31 180 top
R109  470  [R_P2INCH]  92.08,201.93 180 top
R110  470  [R_P2INCH]  92.08,186.69 180 top
R111  10k  [R_P2INCH]  62.23,151.76 180 top
R112  470  [R_P2INCH]  62.23,147.96 0 top
R113  10k  [R_P2INCH]  62.23,149.86 180 top
R114  470  [R_P2INCH]  58.42,157.48 180 top
R115  470  [R_P2INCH]  58.42,142.24 180 top
R116  10k  [R_P2INCH]  95.89,155.57 180 top
R117  470  [R_P2INCH]  95.89,151.76 0 top
R118  10k  [R_P2INCH]  95.89,153.67 180 top
R119  470  [R_P2INCH]  92.08,161.29 180 top
R120  470  [R_P2INCH]  92.08,146.05 180 top
R121  10k  [R_P2INCH]  62.23,111.12 180 top
R122  470  [R_P2INCH]  62.23,107.31 0 top
R123  10k  [R_P2INCH]  62.23,109.22 180 top
R124  470  [R_P2INCH]  58.42,116.84 180 top
R125  470  [R_P2INCH]  58.42,101.6 180 top
R126  10k  [R_P2INCH]  95.89,114.94 180 top
R127  470  [R_P2INCH]  95.89,111.12 0 top
R128  10k  [R_P2INCH]  95.89,113.03 180 top
R129  470  [R_P2INCH]  92.08,120.65 180 top
R130  470  [R_P2INCH]  92.08,105.41 180 top
R131  10k  [R_P2INCH]  62.23,70.48 180 top
R132  470  [R_P2INCH]  62.23,66.67 0 top
R133  10k  [R_P2INCH]  62.23,68.58 180 top
R134  470  [R_P2INCH]  58.42,76.2 180 top
R135  470  [R_P2INCH]  58.42,60.96 180 top
R136  10k  [R_P2INCH]  95.89,74.3 180 top
R137  470  [R_P2INCH]  95.89,70.48 0 top
R138  10k  [R_P2INCH]  95.89,72.39 180 top
R139  470  [R_P2INCH]  92.08,80.01 180 top
R140  470  [R_P2INCH]  92.08,64.77 180 top
R141  10k  [R_P2INCH]  62.23,29.84 180 top
R142  470  [R_P2INCH]  62.23,26.04 0 top
R143  10k  [R_P2INCH]  62.23,27.94 180 top
R144  470  [R_P2INCH]  58.42,35.56 180 top
R145  470  [R_P2INCH]  58.42,20.32 180 top
R146  10k  [R_P2INCH]  95.89,33.66 180 top
R147  470  [R_P2INCH]  95.89,29.84 0 top
R148  10k  [R_P2INCH]  95.89,31.75 180 top
R149  470  [R_P2INCH]  92.08,39.37 180 top
R150  470  [R_P2INCH]  92.08,24.13 180 top
R151  10k  [R_P2INCH]  130.18,240.03 90 top
R152  470  [R_P2INCH]  131.52,235.59 0 top
R153  10k  [R_P2INCH]  131.52,244.47 180 top
R154  470  [R_P2INCH]  128.91,246.38 180 top
R155  470  [R_P2INCH]  128.91,233.68 180 top
R156  10k  [R_P2INCH]  159.38,227.33 270 top
R157  470  [R_P2INCH]  161.93,231.14 270 top
R158  10k  [R_P2INCH]  159.38,234.95 90 top
R159  470  [R_P2INCH]  154.94,238.76 180 top
R160  470  [R_P2INCH]  154.94,223.52 180 top
R161  10k  [R_P2INCH]  130.18,222.25 90 top
R162  470  [R_P2INCH]  131.52,217.81 0 top
R163  10k  [R_P2INCH]  131.52,226.69 180 top
R164  470  [R_P2INCH]  128.91,228.6 180 top
R165  470  [R_P2INCH]  128.91,215.9 180 top
R166  10k  [R_P2INCH]  130.18,199.39 90 top
R167  470  [R_P2INCH]  131.52,194.94 0 top
R168  10k  [R_P2INCH]  131.52,203.84 180 top
R169  470  [R_P2INCH]  128.91,205.74 180 top
R170  470  [R_P2INCH]  128.91,193.04 180 top
R171  10k  [R_P2INCH]  159.38,186.69 270 top
R172  470  [R_P2INCH]  161.93,190.5 270 top
R173  10k  [R_P2INCH]  159.38,194.31 90 top
R174  470  [R_P2INCH]  154.94,198.12 180 top
R175  470  [R_P2INCH]  154.94,182.88 180 top
R176  10k  [R_P2INCH]  130.18,181.61 90 top
R177  470  [R_P2INCH]  131.52,177.16 0 top
R178  10k  [R_P2INCH]  131.52,186.06 180 top
R179  470  [R_P2INCH]  128.91,187.96 180 top
R180  470  [R_P2INCH]  128.91,175.26 180 top
R181  10k  [R_P2INCH]  130.18,158.75 90 top
R182  470  [R_P2INCH]  131.52,154.31 0 top
R183  10k  [R_P2INCH]  131.52,163.19 180 top
R184  470  [R_P2INCH]  128.91,165.1 180 top
R185  470  [R_P2INCH]  128.91,152.4 180 top
R186  10k  [R_P2INCH]  159.38,146.05 270 top
R187  470  [R_P2INCH]  161.93,149.86 270 top
R188  10k  [R_P2INCH]  159.38,153.67 90 top
R189  470  [R_P2INCH]  154.94,157.48 180 top
R190  470  [R_P2INCH]  154.94,142.24 180 top
R191  10k  [R_P2INCH]  130.18,140.97 90 top
R192  470  [R_P2INCH]  131.52,136.53 0 top
R193  10k  [R_P2INCH]  131.52,145.41 180 top
R194  470  [R_P2INCH]  128.91,147.32 180 top
R195  470  [R_P2INCH]  128.91,134.62 180 top
R196  10k  [R_P2INCH]  130.18,118.11 90 top
R197  470  [R_P2INCH]  131.52,113.67 0 top
R198  10k  [R_P2INCH]  131.52,122.56 180 top
R199  470  [R_P2INCH]  128.91,124.46 180 top
R200  470  [R_P2INCH]  128.91,111.76 180 top
R201  10k  [R_P2INCH]  159.38,105.41 270 top
R202  470  [R_P2INCH]  161.93,109.22 270 top
R203  10k  [R_P2INCH]  159.38,113.03 90 top
R204  470  [R_P2INCH]  154.94,116.84 180 top
R205  470  [R_P2INCH]  154.94,101.6 180 top
R206  10k  [R_P2INCH]  130.18,100.33 90 top
R207  470  [R_P2INCH]  131.52,95.89 0 top
R208  10k  [R_P2INCH]  131.52,104.78 180 top
R209  470  [R_P2INCH]  128.91,106.68 180 top
R210  470  [R_P2INCH]  128.91,93.98 180 top
R211  10k  [R_P2INCH]  130.18,77.47 90 top
R212  470  [R_P2INCH]  131.52,73.03 0 top
R213  10k  [R_P2INCH]  131.52,81.92 180 top
R214  470  [R_P2INCH]  128.91,83.82 180 top
R215  470  [R_P2INCH]  128.91,71.12 180 top
R216  10k  [R_P2INCH]  158.75,64.77 270 top
R217  470  [R_P2INCH]  161.29,68.58 270 top
R218  10k  [R_P2INCH]  158.75,72.39 90 top
R219  470  [R_P2INCH]  154.31,76.2 180 top
R220  470  [R_P2INCH]  154.31,60.96 180 top
R221  10k  [R_P2INCH]  130.18,59.69 90 top
R222  470  [R_P2INCH]  131.52,55.24 0 top
R223  10k  [R_P2INCH]  131.52,64.14 180 top
R224  470  [R_P2INCH]  128.91,66.04 180 top
R225  470  [R_P2INCH]  128.91,53.34 180 top
R226  10k  [R_P2INCH]  130.18,36.83 90 top
R227  470  [R_P2INCH]  131.52,32.38 0 top
R228  10k  [R_P2INCH]  131.52,41.27 180 top
R229  470  [R_P2INCH]  128.91,43.18 180 top
R230  470  [R_P2INCH]  128.91,30.48 180 top
R231  10k  [R_P2INCH]  158.75,24.13 270 top
R232  470  [R_P2INCH]  161.29,27.94 270 top
R233  10k  [R_P2INCH]  158.75,31.75 90 top
R234  470  [R_P2INCH]  154.31,35.56 180 top
R235  470  [R_P2INCH]  154.31,20.32 180 top
R236  10k  [R_P2INCH]  130.18,19.05 90 top
R237  470  [R_P2INCH]  131.52,14.61 0 top
R238  10k  [R_P2INCH]  131.52,23.5 180 top
R239  470  [R_P2INCH]  128.91,25.4 180 top
R240  470  [R_P2INCH]  128.91,12.7 180 top
R241  10k  [R_P2INCH]  5.71,316.87 270 top
R242  10k  [R_P2INCH]  5.71,276.23 270 top
R243  10k  [R_P2INCH]  5.71,236.22 270 top
R244  10k  [R_P2INCH]  5.71,195.58 270 top
R245  10k  [R_P2INCH]  5.71,154.94 270 top
R246  10k  [R_P2INCH]  5.71,114.3 270 top
R247  10k  [R_P2INCH]  5.71,74.3 270 top
R248  10k  [R_P2INCH]  5.71,33.02 270 top
R249  10k  [R_P2INCH]  9.53,316.87 270 top
R250  10k  [R_P2INCH]  9.53,276.23 270 top
R251  10k  [R_P2INCH]  9.53,236.22 270 top
R252  10k  [R_P2INCH]  9.53,195.58 270 top
R253  10k  [R_P2INCH]  9.53,154.94 270 top
R254  10k  [R_P2INCH]  9.53,114.3 270 top
R255  10k  [R_P2INCH]  9.53,74.3 270 top
R256  10k  [R_P2INCH]  9.53,33.02 270 top
R257  10k  [R_P2INCH]  25.4,5.71 270 top
R258  470  [R_P2INCH]  32.38,2.54 180 top
R259  470  [R_P2INCH]  7.62,195.58 270 top
R260  470  [R_P2INCH]  7.62,236.22 270 top
R261  470  [R_P2INCH]  7.62,276.23 270 top
R262  470  [R_P2INCH]  7.62,316.87 270 top
R263  470  [R_P2INCH]  3.81,236.22 270 top
R264  470  [R_P2INCH]  7.62,154.94 270 top
R265  470  [R_P2INCH]  7.62,114.3 270 top
R266  470  [R_P2INCH]  7.62,74.3 270 top
R267  470  [R_P2INCH]  7.62,33.02 270 top
R268  10k  [R_P2INCH]  27.3,5.71 270 top
R269  470  [R_P2INCH]  3.81,316.87 270 top
R270  470  [R_P2INCH]  3.81,276.23 270 top
R271  470  [R_P2INCH]  3.81,154.94 270 top
R272  470  [R_P2INCH]  3.81,195.58 270 top
R273  470  [R_P2INCH]  3.81,114.3 270 top
R274  470  [R_P2INCH]  3.81,74.3 270 top
R275  470  [R_P2INCH]  3.81,33.02 270 top
R277  470  [R_P2INCH]  165.1,330.2 0 top
R278  470  [R_P2INCH]  163.83,293.37 0 top
R279  470  [R_P2INCH]  163.83,252.73 0 top
R280  470  [R_P2INCH]  163.83,212.09 0 top
R281  470  [R_P2INCH]  163.83,171.45 0 top
R282  470  [R_P2INCH]  163.83,130.81 0 top
R283  470  [R_P2INCH]  163.83,90.17 0 top
R284  470  [R_P2INCH]  163.83,49.53 0 top
R285  10k  [R_P2INCH]  24.77,335.92 270 top
R286  470  [R_P2INCH]  171.45,26.04 180 top
R287  10k  [R_P2INCH]  171.45,27.94 180 top
R288  470  [R_P2INCH]  14.61,332.74 180 top
R289  10k  [R_P2INCH]  26.67,335.92 90 top
TP1  [TEST_LOOP]  9.53,3.81 270 top
TP2  [TEST_LOOP]  5.08,339.09 270 top
TP3  [TEST_LOOP]  171.45,8.89 0 top
TP4  [TEST_LOOP]  59.69,287.02 90 top
TP5  [TEST_LOOP]  52.7,205.1 90 top
TP6  [TEST_LOOP]  52.7,123.83 90 top
TP7  [TEST_LOOP]  52.7,43.18 90 top

## Tracks (layer width: path | path; a pad name or v marks a point on that pad's centre or on a via)
+5V
  pour Route3: 2.54,349.25 173.99,349.25 173.99,2.54 2.54,2.54
ADD_R0  (via drill 0.5 pad 1.02)
  Top 0.61: v71.75,315.6 v83.19,315.6 | v90.81,322.58 97.79,322.58 Q30.G | v123.83,323.85 v112.39,323.85
  Bottom 0.61: R28.1 66.04,312.42 Q26.D 69.22,311.15 69.85,311.79 69.85,313.69 v71.75,315.6 | Q30.G 100.33,323.85 v112.39,323.85 | v83.19,315.6 83.19,322.58 v90.81,322.58 | Q43.G v123.83,323.85
ADD_R0_N  (via drill 0.5 pad 1.02)
  Top 0.61: v123.83,313.06 v113.67,313.06 | v85.09,316.87 v71.12,316.87
  Bottom 0.61: Q24.D 58.42,311.79 R27.1 | R27.1 63.5,314.32 R26.1 66.04,314.96 67.94,314.96 68.58,314.32 | 68.58,314.32 Q26.G | R27.1 60.96,309.25 Q22.D | R50.1 130.18,313.06 v123.83,313.06 | v113.67,313.06 111.12,313.06 108.58,310.51 Q28.G 96.52,308.61 R35.1 92.71,308.61 91.44,309.88 90.17,309.88 v85.09,316.87 | v71.12,316.87 70.48,316.87 68.58,314.96 68.58,314.32
ADD_R1  (via drill 0.5 pad 1.02)
  Top 0.61: v74.3,273.05 v83.19,273.05 | v90.81,281.94 97.79,281.94 Q40.G | v112.39,283.21 v123.83,283.21
  Bottom 0.61: R38.1 66.04,271.78 Q36.D 69.85,270.51 71.12,271.78 73.03,271.78 v74.3,273.05 | Q40.G 100.33,283.21 v112.39,283.21 | v83.19,273.05 83.19,281.94 v90.81,281.94 | v123.83,283.21 Q49.G
ADD_R1_N  (via drill 0.5 pad 1.02)
  Top 0.61: v123.83,272.42 v113.67,272.42 | v84.45,274.32 v74.3,274.32
  Bottom 0.61: R37.1 60.96,268.61 Q32.D | R37.1 63.5,273.69 R36.1 65.41,274.32 67.94,274.32 68.58,273.69 | Q34.D 58.42,271.14 R37.1 | 68.58,273.69 Q36.G | R60.1 130.18,272.42 v123.83,272.42 | v113.67,272.42 108.58,272.42 106.05,269.88 Q38.G 97.16,267.97 R45.1 92.71,267.97 91.44,269.24 90.17,269.24 87.63,271.78 v84.45,274.32 | v74.3,274.32 69.22,274.32 68.58,273.69
ADD_R2  (via drill 0.5 pad 1.02)
  Top 0.61: v123.83,242.57 v112.39,242.57 | v76.2,232.41 v83.19,232.41 | v90.81,241.3 97.79,241.3 Q87.G
  Bottom 0.61: R93.1 66.04,231.14 Q83.D 69.22,229.87 70.48,231.14 72.39,231.14 73.66,232.41 v76.2,232.41 | Q140.G v123.83,242.57 | v112.39,242.57 100.33,242.57 Q87.G | v83.19,232.41 83.19,241.3 v90.81,241.3
ADD_R2_N  (via drill 0.5 pad 1.02)
  Top 0.61: v123.83,231.78 v113.67,231.78 | v84.45,233.68 v74.93,233.68
  Bottom 0.61: R92.1 60.96,227.97 Q79.D | Q81.D 58.42,230.5 R92.1 | R92.1 63.5,233.04 R91.1 65.41,233.68 67.94,233.68 68.58,233.04 | 68.58,233.04 Q83.G | R155.1 129.54,231.78 v123.83,231.78 | v113.67,231.78 111.76,231.78 109.22,229.24 Q85.G 96.52,227.33 R100.1 92.71,227.33 91.44,228.6 90.81,228.6 v84.45,233.68 | v74.93,233.68 69.22,233.68 68.58,233.04
ADD_R3  (via drill 0.5 pad 1.02)
  Top 0.61: v123.83,201.93 v112.39,201.93 | v76.2,191.77 v83.19,191.77 | v90.81,200.66 97.79,200.66 Q97.G
  Bottom 0.61: R103.1 66.04,190.5 Q93.D 69.85,189.23 71.12,190.5 74.93,190.5 v76.2,191.77 | Q149.G v123.83,201.93 | v112.39,201.93 100.33,201.93 Q97.G | v83.19,191.77 83.19,200.66 v90.81,200.66
ADD_R3_N  (via drill 0.5 pad 1.02)
  Top 0.61: v123.83,191.13 v113.67,191.13 | v84.45,193.04 v74.93,193.04
  Bottom 0.61: R102.1 63.5,192.41 R101.1 66.04,193.68 68.58,193.04 | R102.1 60.96,187.32 Q89.D | R170.1 129.54,191.13 v123.83,191.13 | v113.67,191.13 110.49,191.13 107.95,188.59 Q95.G 96.52,186.69 R110.1 92.71,186.69 91.44,187.96 90.17,187.96 v84.45,193.04 | 68.58,193.04 Q93.G | Q91.D 58.42,189.87 R102.1 | v74.93,193.04 68.58,193.04
ADD_R4  (via drill 0.5 pad 1.02)
  Top 0.61: v123.83,161.29 v112.39,161.29 | v76.2,151.13 v83.19,151.13 | v90.81,160.02 97.79,160.02 Q107.G
  Bottom 0.406: R113.1 66.04,149.86
  Bottom 0.61: 66.04,149.86 Q103.D 69.22,148.59 70.48,149.86 73.66,149.86 74.93,151.13 v76.2,151.13 | Q158.G v123.83,161.29 | v112.39,161.29 100.97,161.29 Q107.G | v83.19,151.13 83.19,160.02 v90.81,160.02
ADD_R4_N  (via drill 0.5 pad 1.02)
  Top 0.61: v113.67,150.5 v123.83,150.5 | v84.45,152.4 v74.93,152.4
  Bottom 0.61: Q101.D 58.42,149.22 R112.1 | R112.1 63.5,151.76 R111.1 65.41,152.4 67.94,152.4 68.58,151.76 | 68.58,151.76 Q103.G | R112.1 60.96,146.69 Q99.D | v113.67,150.5 112.39,150.5 110.49,147.96 Q105.G 96.52,146.05 R120.1 92.08,146.05 90.81,147.32 90.17,147.32 85.09,152.4 v84.45,152.4 | v123.83,150.5 129.54,150.5 R185.1 | v74.93,152.4 69.22,152.4 68.58,151.76
ADD_R5  (via drill 0.5 pad 1.02)
  Top 0.61: v123.83,120.65 v112.39,120.65 | v76.2,110.49 v83.82,110.49 | v90.81,119.38 97.79,119.38 Q117.G
  Bottom 0.61: R123.1 66.04,109.22 Q113.D 69.22,107.95 70.48,109.22 74.93,109.22 v76.2,110.49 | Q167.G v123.83,120.65 | v112.39,120.65 100.33,120.65 Q117.G | v83.82,110.49 83.82,119.38 v90.81,119.38
ADD_R5_N  (via drill 0.5 pad 1.02)
  Top 0.61: v113.67,109.86 v123.83,109.86 | v85.09,111.76 v74.93,111.76
  Bottom 0.61: Q111.D 58.42,108.58 R122.1 | R122.1 63.5,111.12 R121.1 66.04,111.76 67.94,111.76 68.58,111.12 | R122.1 60.96,106.05 Q109.D | 68.58,111.12 Q113.G | v113.67,109.86 110.49,109.86 109.22,107.31 Q115.G 96.52,105.41 R130.1 92.08,105.41 91.44,106.68 90.17,106.68 v85.09,111.76 | v123.83,109.86 129.54,109.86 R200.1 | v74.93,111.76 69.22,111.76 68.58,111.12
ADD_R6  (via drill 0.5 pad 1.02)
  Top 0.61: v123.83,80.01 v112.39,80.01 | v76.2,69.85 v83.82,69.85 | v90.81,78.74 97.16,78.74 Q127.G
  Bottom 0.61: R133.1 66.04,68.58 Q123.D 69.85,67.31 71.12,68.58 73.66,68.58 74.93,69.85 v76.2,69.85 | Q176.G v123.83,80.01 | v112.39,80.01 100.33,80.01 Q127.G | v83.82,69.85 83.82,78.74 v90.81,78.74
ADD_R6_N  (via drill 0.5 pad 1.02)
  Top 0.61: v123.83,69.22 v113.67,69.22 | v85.09,71.12 v74.93,71.12
  Bottom 0.61: Q121.D 58.42,67.94 R132.1 | R132.1 63.5,70.48 R131.1 66.04,71.12 67.94,71.12 68.58,70.48 | 68.58,70.48 Q123.G | R132.1 60.96,66.04 Q119.D | R215.1 129.54,69.22 v123.83,69.22 | v113.67,69.22 109.22,69.22 106.68,66.67 Q125.G 97.16,64.77 R140.1 92.71,64.77 91.44,66.04 88.9,66.04 v85.09,71.12 | v74.93,71.12 69.22,71.12 68.58,70.48
ADD_R7  (via drill 0.5 pad 1.02)
  Top 0.61: v76.2,29.21 v83.82,29.21 | v123.83,39.37 v112.39,39.37 | Q137.G 97.16,38.1 v90.81,38.1
  Bottom 0.61: R143.1 66.04,27.94 Q133.D 69.22,26.67 70.48,27.94 72.39,27.94 73.66,29.21 v76.2,29.21 | Q185.G v123.83,39.37 | v112.39,39.37 100.33,39.37 Q137.G | v83.82,29.21 83.82,38.1 v90.81,38.1
ADD_R7_N  (via drill 0.5 pad 1.02)
  Top 0.61: v85.09,30.48 v74.93,30.48
  Bottom 0.61: Q131.D 58.42,27.3 R142.1 | R142.1 63.5,29.84 R141.1 66.04,30.48 67.94,30.48 68.58,29.84 | R142.1 60.96,24.77 Q129.D | 68.58,29.84 Q133.G | v85.09,30.48 92.71,24.13 R150.1 96.52,24.13 Q135.G 105.41,26.04 108.28,28.33 | v74.93,30.48 69.22,30.48 68.58,29.84 | 108.28,28.33 108.58,28.57 | R230.1 129.54,28.57 108.52,28.57 108.28,28.33
CARRY_IN  (via drill 0.5 pad 1.02)
  Top 0.61: v123.83,318.77 v112.39,318.77 | v101.6,312.42 100.97,313.06 94.61,313.06 Q27.G | v32.38,331.47 66.04,331.47 67.31,330.2 67.31,323.21 69.22,321.31 82.55,321.31 v85.09,318.77
  Bottom 0.61: Q42.G v123.83,318.77 | v112.39,318.77 106.05,312.42 v101.6,312.42 | Q213.D 23.5,335.28 24.77,335.28 R289.1 30.48,333.38 v32.38,331.47 | v85.09,318.77 91.44,312.42 Q27.G
CARRY_IN_N  (via drill 0.5 pad 1.02)
  Top 0.61: v112.39,325.12 v123.83,325.12 | v38.1,333.38 66.67,333.38 v70.48,329.56
  Bottom 0.61: R34.1 93.34,321.94 Q29.G | R34.1 95.89,325.12 v112.39,325.12 | v123.83,325.12 125.09,326.39 127,326.39 128.91,327.66 R49.1 | R288.1 17.14,334.01 18.41,335.28 Q213.G 22.23,336.55 Q212.D 24.13,337.82 R285.1 24.77,339.09 26.04,340.36 31.11,340.36 v38.1,333.38 | v70.48,329.56 88.9,329.56 R34.1
CARRY_IN_RAW
  Bottom 0.61: TP2.P$1 Q212.G
CARRY_OUT
  Bottom 0.406: 158.12,29.21 R233.1
  Bottom 0.61: Q189.D R233.1 158.75,29.84 161.29,32.38 Q211.G 171.45,22.86 173.99,20.32 173.99,11.43 TP3.P$1
CARRY_OUT_N
  Bottom 0.61: Q187.D 153.67,29.21 Q189.G 156.84,27.94 R231.1 | R231.1 Q188.D | R231.1 161.29,29.21 R232.1
CARRY_OUT_N2
  Bottom 0.61: Q211.D 172.72,29.21 R287.1 R286.1
CGEN_S0  (via drill 0.5 pad 1.02)
  Top 0.61: v157.48,326.39 v138.43,326.39
  Bottom 0.61: Q44.D R48.1 134.62,326.39 v138.43,326.39 | Q45.G 157.48,316.23 158.75,317.5 160.02,317.5 160.66,318.13 160.66,323.21 v157.48,326.39
CRY0  (via drill 0.5 pad 1.02)
  Top 0.61: v123.83,278.13 v112.39,278.13 | v101.6,271.78 100.97,272.42 94.61,272.42 Q37.G | v138.43,287.02 v154.94,287.02
  Bottom 0.61: Q47.D R53.1 161.29,316.23 166.37,316.23 167.64,314.96 167.64,303.53 164.47,300.36 164.47,288.93 162.56,287.02 v154.94,287.02 | v123.83,278.13 Q48.G 132.08,282.57 132.08,285.12 133.99,287.02 v138.43,287.02 | v112.39,278.13 106.05,271.78 v101.6,271.78
CRY0_N  (via drill 0.5 pad 1.02)
  Top 0.61: v154.94,288.29 v138.43,288.29 | v112.39,284.48 v123.83,284.48
  Bottom 0.61: Q45.D 154.31,313.69 Q47.G 158.12,312.42 R51.1 | R51.1 161.93,313.69 R52.1 | R51.1 159.38,309.88 Q46.D 154.94,304.8 v154.94,288.29 | Q39.G 93.34,281.94 R44.1 95.89,284.48 v112.39,284.48 | v138.43,288.29 132.72,288.29 R59.1 128.27,287.02 127,285.75 125.09,285.75 v123.83,284.48
CRY1  (via drill 0.5 pad 1.02)
  Top 0.61: v123.83,237.49 v112.39,237.49 | v101.6,231.14 100.97,231.78 94.61,231.78 Q84.G | v138.43,246.38 v154.94,246.38
  Bottom 0.61: Q53.D R63.1 161.29,275.59 165.74,275.59 167.64,274.32 167.64,255.91 164.47,252.73 164.47,248.28 162.56,246.38 v154.94,246.38 | v123.83,237.49 Q139.G 132.08,242.57 132.08,244.47 133.99,246.38 v138.43,246.38 | v112.39,237.49 104.78,231.14 v101.6,231.14
CRY1_N  (via drill 0.5 pad 1.02)
  Top 0.61: v154.94,247.65 v138.43,247.65 | v112.39,243.84 v123.83,243.84
  Bottom 0.61: Q51.D 154.31,273.05 Q53.G 158.12,271.78 R61.1 | R61.1 159.38,269.24 Q52.D 154.94,264.16 v154.94,247.65 | R61.1 161.93,273.05 R62.1 | Q86.G 93.34,240.66 R99.1 95.89,243.84 v112.39,243.84 | v138.43,247.65 132.72,247.65 R154.1 128.91,246.38 127.64,245.11 125.73,245.11 v123.83,243.84
CRY2  (via drill 0.5 pad 1.02)
  Top 0.61: v123.83,196.85 v112.39,196.85 | v101.6,190.5 100.97,191.13 94.61,191.13 Q94.G | v138.43,205.74 v154.94,205.74
  Bottom 0.61: Q144.D R158.1 161.29,234.95 165.1,234.95 166.37,233.68 166.37,224.16 163.83,221.62 163.83,207.65 161.93,205.74 v154.94,205.74 | v123.83,196.85 Q148.G 132.08,201.29 132.08,204.47 133.35,205.74 v138.43,205.74 | v112.39,196.85 111.76,196.22 106.68,190.5 v101.6,190.5
CRY2_N  (via drill 0.5 pad 1.02)
  Top 0.61: v154.94,207.01 v138.43,207.01 | v112.39,203.2 v123.83,203.2
  Bottom 0.61: R156.1 161.93,232.41 R157.1 | Q142.D 154.31,232.41 Q144.G 158.12,231.14 R156.1 | R156.1 159.38,228.6 Q143.D 154.94,223.52 v154.94,207.01 | Q96.G 93.34,200.66 R109.1 96.52,203.2 v112.39,203.2 | v138.43,207.01 132.72,207.01 R169.1 128.27,205.74 127,204.47 125.09,204.47 v123.83,203.2
CRY3  (via drill 0.5 pad 1.02)
  Top 0.61: Q104.G 93.98,150.5 100.97,150.5 v101.6,149.86 | v112.39,156.21 v123.83,156.21 | v138.43,165.1 v154.94,165.1
  Bottom 0.61: Q153.D R173.1 161.29,194.31 165.74,194.31 167.64,192.41 167.64,184.15 164.47,180.97 164.47,167 162.56,165.1 v154.94,165.1 | v101.6,149.86 107.31,149.86 109.22,151.76 v112.39,156.21 | v123.83,156.21 Q157.G 132.08,160.66 132.08,163.19 133.35,165.1 v138.43,165.1
CRY3_N  (via drill 0.5 pad 1.02)
  Top 0.61: v154.94,166.37 v138.43,166.37 | v112.39,162.56 v123.83,162.56
  Bottom 0.406: 158.75,189.23 R171.1
  Bottom 0.61: 158.75,189.23 Q152.D 154.94,183.51 v154.94,166.37 | Q151.D 154.31,191.77 Q153.G 158.12,190.5 R171.1 161.93,191.77 R172.1 | Q106.G 93.34,160.02 R119.1 96.52,162.56 v112.39,162.56 | v138.43,166.37 132.08,166.37 132.08,165.74 R184.1 128.27,165.1 127,163.83 125.09,163.83 v123.83,162.56
CRY4  (via drill 0.5 pad 1.02)
  Top 0.61: v123.83,115.57 v112.39,115.57 | v101.6,109.22 100.97,109.86 93.98,109.86 Q114.G | v138.43,124.46 v154.94,124.46
  Bottom 0.61: Q162.D R188.1 160.66,153.67 164.47,153.67 166.37,151.76 166.37,134.62 164.47,132.72 164.47,125.73 163.19,124.46 v154.94,124.46 | v123.83,115.57 Q166.G 132.08,120.02 132.08,123.19 133.35,124.46 v138.43,124.46 | v112.39,115.57 108.58,109.22 v101.6,109.22
CRY4_N  (via drill 0.5 pad 1.02)
  Top 0.61: v154.94,125.73 v138.43,125.73 | v112.39,121.92 v123.83,121.92
  Bottom 0.61: Q160.D 154.31,151.13 Q162.G 158.75,149.86 R186.1 | R186.1 Q161.D 154.94,142.88 v154.94,125.73 | R186.1 R187.1 | Q116.G 93.34,119.38 R129.1 96.52,121.92 v112.39,121.92 | v138.43,125.73 132.72,125.73 R199.1 128.91,124.46 127.64,123.19 125.09,123.19 v123.83,121.92
CRY5  (via drill 0.5 pad 1.02)
  Top 0.61: v123.83,74.93 v112.39,74.93 | v101.6,68.58 100.97,69.22 94.61,69.22 Q124.G | v138.43,83.82 v154.94,83.82
  Bottom 0.61: Q171.D R203.1 161.29,113.67 165.1,113.67 166.37,112.39 166.37,104.14 164.47,102.23 164.47,85.72 162.56,83.82 v154.94,83.82 | v123.83,74.93 Q175.G 132.08,80.01 132.08,81.92 133.99,83.82 v138.43,83.82 | v112.39,74.93 106.68,68.58 v101.6,68.58
CRY5_N  (via drill 0.5 pad 1.02)
  Top 0.61: v154.94,85.09 v138.43,85.09 | v112.39,81.28 v123.83,81.28
  Bottom 0.61: R201.1 158.12,109.22 Q171.G 154.31,110.49 Q169.D | R201.1 Q170.D 154.94,102.23 v154.94,85.09 | R201.1 R202.1 | Q126.G 93.34,78.74 R139.1 96.52,81.28 v112.39,81.28 | v138.43,85.09 132.72,85.09 R214.1 128.91,83.82 127,82.55 125.73,82.55 v123.83,81.28
CRY6  (via drill 0.5 pad 1.02)
  Top 0.61: v101.6,27.94 100.97,28.57 94.61,28.57 Q134.G | v138.43,43.18 v153.67,43.18
  Bottom 0.61: Q180.D R218.1 158.75,71.12 159.38,71.75 161.29,73.03 165.1,73.03 167.64,71.12 167.64,66.04 164.47,63.5 164.47,46.99 161.29,43.18 v153.67,43.18 | v101.6,27.94 106.05,27.94 112.39,34.29 Q184.G 132.08,38.73 132.08,41.27 133.99,43.18 v138.43,43.18
CRY6_N  (via drill 0.5 pad 1.02)
  Top 0.61: v112.39,40.64 v123.83,40.64 | v138.43,44.45 v153.67,44.45
  Bottom 0.61: Q136.G 93.34,38.1 R149.1 95.89,40.64 v112.39,40.64 | R216.1 161.29,69.85 R217.1 | R216.1 157.48,68.58 Q180.G 153.67,69.85 Q178.D | R216.1 158.12,67.31 156.21,65.41 Q179.D 153.67,60.96 v153.67,44.45 | v123.83,40.64 125.73,41.91 127,41.91 128.27,43.18 R229.1 132.72,44.45 v138.43,44.45
DO_INVERT
  Bottom 0.61: Q12.G 26.67,314.32 27.3,313.69 29.21,313.69 29.84,313.06 29.84,311.79 26.67,309.88 18.41,302.26 18.41,280.04 Q17.G 26.04,273.69 26.67,273.05 28.57,273.05 29.21,272.42 29.21,271.14 26.04,268.61 19.05,261.62 19.05,240.03 Q1.G 26.67,233.04 27.3,232.41 29.21,232.41 29.84,231.78 29.84,229.87 26.67,227.33 18.41,221.62 18.41,198.75 Q6.G 26.04,192.41 26.67,191.77 28.57,191.77 29.21,191.13 29.21,190.5 18.41,179.71 18.41,158.75 Q11.G 26.04,151.76 26.67,151.13 28.57,151.13 29.21,150.5 29.21,149.22 26.04,146.69 18.41,140.34 18.41,119.38 Q64.G 26.04,111.12 26.67,110.49 28.57,110.49 29.21,109.86 29.21,107.31 26.04,104.78 19.05,99.06 19.05,76.2 Q69.G 26.67,69.85 28.57,69.85 29.21,69.22 29.21,67.94 26.67,65.41 19.05,59.05 19.05,36.83 Q74.G 26.67,29.84 27.3,29.21 29.21,29.21 29.84,28.57 29.84,8.89 | Q210.D 34.29,8.89 29.84,8.89 | 29.84,8.89 27.94,8.89 R268.1
DO_INVERT_N
  Top 0.61: R89.1 26.67,41.91 Q76.G | R14.1 26.04,163.83 Q61.G | Q66.G 26.04,123.19 R79.1 | R84.1 26.67,82.55 Q71.G | R9.1 26.04,204.47 Q8.G | R4.1 26.67,245.11 Q3.G | R24.1 26.04,285.75 Q19.G | R19.1 26.67,326.39 Q14.G
  Bottom 0.61: Q71.G 29.21,77.47 29.21,74.3 31.11,72.39 34.29,72.39 34.29,46.99 R89.1 | R84.1 27.94,85.72 34.29,90.17 34.29,112.39 33.66,113.03 29.84,113.03 28.57,114.94 28.57,118.75 Q66.G | R79.1 27.3,126.36 34.29,132.08 34.29,153.03 33.66,153.67 29.84,153.67 29.21,154.94 29.21,158.12 Q61.G | R14.1 27.3,168.91 34.29,172.72 34.29,193.04 33.02,194.31 29.84,194.31 27.94,196.85 27.94,200.03 Q8.G | R9.1 27.3,209.55 34.29,214 34.29,234.31 33.66,234.95 29.84,234.95 28.57,236.85 28.57,240.66 Q3.G | R4.1 27.94,249.56 34.29,254.63 34.29,274.32 33.02,275.59 29.84,275.59 28.57,277.5 28.57,280.67 Q19.G | R24.1 27.3,290.19 34.92,296.55 34.92,315.6 34.29,316.23 31.11,316.23 29.21,318.13 29.21,321.31 Q14.G | Q210.G 34.29,3.17 R258.1 | Q210.G 33.02,7.62 Q209.D 28.57,7.62 27.94,6.99 26.67,6.99 R257.1 | Q76.G 29.21,36.83 29.21,33.02 30.48,31.75 34.29,31.75 34.92,31.11 34.92,13.97 38.1,10.79 38.1,7.62 36.83,6.35 Q210.G
DO_INVERT_RAW
  Bottom 0.61: Q209.G 28.57,5.08 20.32,5.08 16.51,8.89 8.26,8.89 6.99,7.62 6.99,6.35 TP1.P$1
GND
  pour Route2: 2.54,349.25 173.99,349.25 173.99,2.54 2.54,2.54
IN_A0  (via drill 0.5 pad 1.02)
  Top 0.406: v62.23,342.9 62.87,343.54 144.78,343.54 v149.22,339.09
  Top 0.61: v41.27,330.2 v64.77,330.2 | v123.83,306.07 117.47,299.72 v114.94,299.72 | v149.86,307.34 v138.43,307.34